# Altium project roach2_project rev2.PrjPCB (part 3 of 13)

## Sheet jtag_levelxlate.SchDoc: JTAG and Level Translation
size A3; Date: DO NOT USE, RATHER USE PROJ OPTIONS; DrawnBy: DO NOT USE, RATHER USE PROJ OPTIONS; Engineer: DO NOT USE, RATHER USE PROJ OPTIONS; Organization: DO NOT USE, RATHER USE PROJ OPTIONS; DocumentNumber: DO NOT USE, RATHER USE PROJ OPTIONS; Revision: DO NOT USE, RATHER USE PROJ OPTIONS; SheetNumber: 26; SheetTotal: 27; SCH_Sheet_Filename: jtag_levelxlate.SchDoc; CurrentTime: DO NOT USE, RATHER USE PROJ OPTIONS; Time: DO NOT USE, RATHER USE PROJ OPTIONS; DocumentFullPathAndName: DO NOT USE, RATHER USE PROJ OPTIONS; DocumentName: DO NOT USE, RATHER USE PROJ OPTIONS; ModifiedDate: DO NOT USE, RATHER USE PROJ OPTIONS; ImagePath: DO NOT USE, RATHER USE PROJ OPTIONS
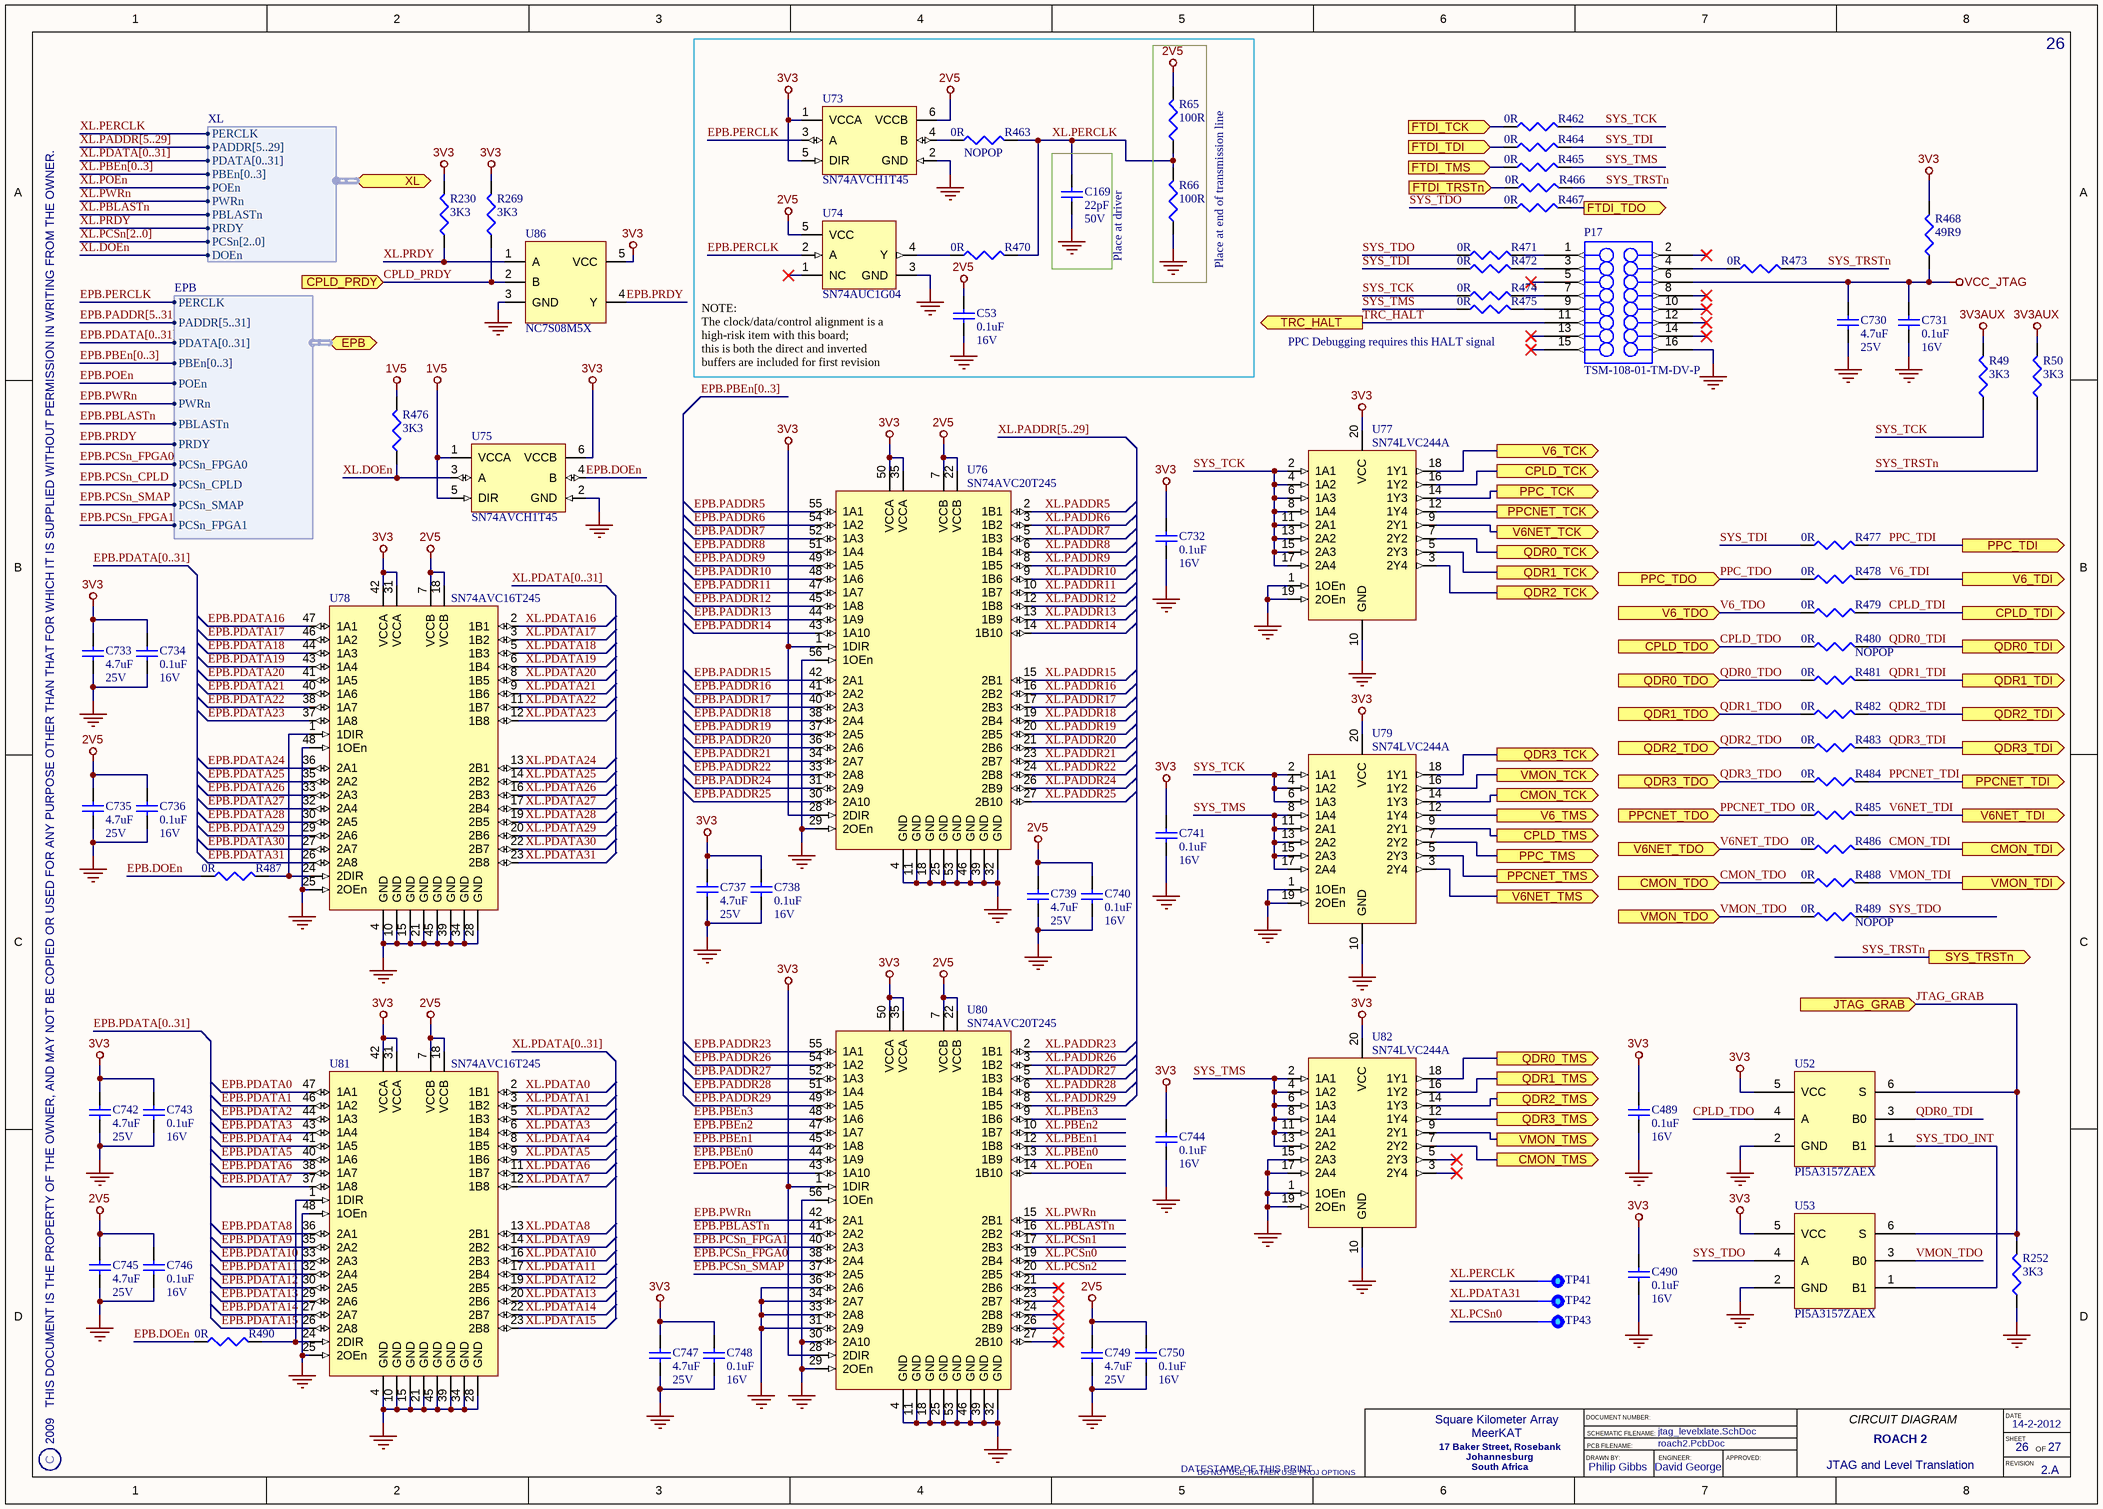
[diagram p4: jtag_levelxlate.SchDoc]

### Parts
C53  Rating: 16V  [CAPC1005X60L]  (hidden comment: 0.1uF)
C169  Rating: 50V  [CAPC1005X55L]  (hidden comment: 22pF)
C489  Rating: 16V  [CAPC1005X60L]  (hidden comment: 0.1uF)
C490  Rating: 16V  [CAPC1005X60L]  (hidden comment: 0.1uF)
C730  Rating: 25V  [CAPC2012X127L]  (hidden comment: 4.7uF)
C731  Rating: 16V  [CAPC1005X60L]  (hidden comment: 0.1uF)
C732  Rating: 16V  [CAPC1005X60L]  (hidden comment: 0.1uF)
C733  Rating: 25V  [CAPC2012X127L]  (hidden comment: 4.7uF)
C734  Rating: 16V  [CAPC1005X60L]  (hidden comment: 0.1uF)
C735  Rating: 25V  [CAPC2012X127L]  (hidden comment: 4.7uF)
C736  Rating: 16V  [CAPC1005X60L]  (hidden comment: 0.1uF)
C737  Rating: 25V  [CAPC2012X127L]  (hidden comment: 4.7uF)
C738  Rating: 16V  [CAPC1005X60L]  (hidden comment: 0.1uF)
C739  Rating: 25V  [CAPC2012X127L]  (hidden comment: 4.7uF)
C740  Rating: 16V  [CAPC1005X60L]  (hidden comment: 0.1uF)
C741  Rating: 16V  [CAPC1005X60L]  (hidden comment: 0.1uF)
C742  Rating: 25V  [CAPC2012X127L]  (hidden comment: 4.7uF)
C743  Rating: 16V  [CAPC1005X60L]  (hidden comment: 0.1uF)
C744  Rating: 16V  [CAPC1005X60L]  (hidden comment: 0.1uF)
C745  Rating: 25V  [CAPC2012X127L]  (hidden comment: 4.7uF)
C746  Rating: 16V  [CAPC1005X60L]  (hidden comment: 0.1uF)
C747  Rating: 25V  [CAPC2012X127L]  (hidden comment: 4.7uF)
C748  Rating: 16V  [CAPC1005X60L]  (hidden comment: 0.1uF)
C749  Rating: 25V  [CAPC2012X127L]  (hidden comment: 4.7uF)
C750  Rating: 16V  [CAPC1005X60L]  (hidden comment: 0.1uF)
P17  TSM-108-01-TM-DV-P  [SAMTEC_TSM-108-01-TM-DV-P]
R49  3K3  [RESC1005X40L]
R50  3K3  [RESC1005X40L]
R65  100R  [RESC1005X40L]
R66  100R  [RESC1005X40L]
R230  3K3  [RESC1005X40L]
R252  3K3  [RESC1005X40L]
R269  3K3  [RESC1005X40L]
R462  0R  [RESC1005X40L]
R463  0R  [RESC1005X40L]
R464  0R  [RESC1005X40L]
R465  0R  [RESC1005X40L]
R466  0R  [RESC1005X40L]
R467  0R  [RESC1005X40L]
R468  49R9  [RESC1005X40L]
R470  0R  [RESC1005X40L]
R471  0R  [RESC1005X40L]
R472  0R  [RESC1005X40L]
R473  0R  [RESC1005X40L]
R474  0R  [RESC1005X40L]
R475  0R  [RESC1005X40L]
R476  3K3  [RESC1005X40L]
R477  0R  [RESC1005X40L]
R478  0R  [RESC1005X40L]
R479  0R  [RESC1005X40L]
R480  0R  [RESC1005X40L]
R481  0R  [RESC1005X40L]
R482  0R  [RESC1005X40L]
R483  0R  [RESC1005X40L]
R484  0R  [RESC1005X40L]
R485  0R  [RESC1005X40L]
R486  0R  [RESC1005X40L]
R487  0R  [RESC1005X40L]
R488  0R  [RESC1005X40L]
R489  0R  [RESC1005X40L]
R490  0R  [RESC1005X40L]
TP41  Testpoint  [TP100]  (value not drawn)  (no BOM)
TP42  Testpoint  [TP100]  (value not drawn)  (no BOM)
TP43  Testpoint  [TP100]  (value not drawn)  (no BOM)
U52  PI5A3157ZAEX  [SC70-6]
U53  PI5A3157ZAEX  [SC70-6]
U73  SN74AVCH1T45  [SOT23-6]
U74  SN74AUC1G04  [SOT23-5]
U75  SN74AVCH1T45  [SOT23-6]
U76  SN74AVC20T245  [PW056]
U77  SN74LVC244A  [PW020]
U78  SN74AVC16T245  [PW048]
U79  SN74LVC244A  [PW020]
U80  SN74AVC20T245  [PW056]
U81  SN74AVC16T245  [PW048]
U82  SN74LVC244A  [PW020]
U86  NC7S08M5X  [SOT23-5]

### Ports
CMON_TCK (out), CMON_TDI (out), CMON_TDO (in), CMON_TMS (out), CPLD_PRDY (in), CPLD_TCK (out), CPLD_TDI (out), CPLD_TDO (in), CPLD_TMS (out), EPB (harness EPB), FTDI_TCK (in), FTDI_TDI (in), FTDI_TDO (out), FTDI_TMS (in), FTDI_TRSTn (in), JTAG_GRAB (in), PPC_TCK (out), PPC_TDI (out), PPC_TDO (in), PPC_TMS (out), PPCNET_TCK (out), PPCNET_TDI (out), PPCNET_TDO (in), PPCNET_TMS (out), QDR0_TCK (out), QDR0_TDI (out), QDR0_TDO (in), QDR0_TMS (out), QDR1_TCK (out), QDR1_TDI (out), QDR1_TDO (in), QDR1_TMS (out), QDR2_TCK (out), QDR2_TDI (out), QDR2_TDO (in), QDR2_TMS (out), QDR3_TCK (out), QDR3_TDI (out), QDR3_TDO (in), QDR3_TMS (out), SYS_TRSTn (out), TRC_HALT (out), V6_TCK (out), V6_TDI (out), V6_TDO (in), V6_TMS (out), V6NET_TCK (out), V6NET_TDI (out), V6NET_TDO (in), V6NET_TMS (out), VMON_TCK (out), VMON_TDI (out), VMON_TDO (in), VMON_TMS (out), XL (harness XL)

### Harnesses
EPB: PERCLK, PADDR[5..31], PDATA[0..31], PBEn[0..3], POEn, PWRn, PBLASTn, PRDY, PCSn_FPGA0, PCSn_CPLD, PCSn_SMAP, PCSn_FPGA1
XL: PERCLK, PADDR[5..29], PDATA[0..31], PBEn[0..3], POEn, PWRn, PBLASTn, PRDY, PCSn[2..0], DOEn

### Nets
1V5: R476.2 U75.1(VCCA) U75.5(DIR)
2V5: C53.2 C735.2 C736.2 C739.2 C740.2 C745.2 C746.2 C749.2 C750.2 R65.2 U73.6(VCCB) U74.5(VCC) U76.7(VCCB) U76.22(VCCB) U78.7(VCCB) U78.18(VCCB) U80.7(VCCB) U80.22(VCCB) U81.7(VCCB) U81.18(VCCB)
3V3: C489.2 C490.2 C732.2 C733.2 C734.2 C737.2 C738.2 C741.2 C742.2 C743.2 C744.2 C747.2 C748.2 R230.2 R269.2 R468.2 U52.5(VCC) U53.5(VCC) U73.1(VCCA) U73.5(DIR) U75.6(VCCB) U76.1(1DIR) U76.28(2DIR) U76.35(VCCA) U76.50(VCCA) U77.20(VCC) U78.31(VCCA) U78.42(VCCA) U79.20(VCC) U80.1(1DIR) U80.28(2DIR) U80.35(VCCA) U80.50(VCCA) U81.31(VCCA) U81.42(VCCA) U82.20(VCC) U86.5(VCC)
3V3AUX: R49.2 R50.2
GND: C53.1 C169.1 C489.1 C490.1 C730.1 C731.1 C732.1 C733.1 C734.1 C735.1 C736.1 C737.1 C738.1 C739.1 C740.1 C741.1 C742.1 C743.1 C744.1 C745.1 C746.1 C747.1 C748.1 C749.1 C750.1 P17.16(B16) R66.1 R252.1 U52.2(GND) U53.2(GND) U73.2(GND) U74.3(GND) U75.2(GND) U76.4(GND) U76.11(GND) U76.18(GND) U76.25(GND) U76.29(2OEn) U76.32(GND) U76.39(GND) U76.46(GND) U76.53(GND) U76.56(1OEn) U77.1(1OEn) U77.10(GND) U77.19(2OEn) U78.4(GND) U78.10(GND) U78.15(GND) U78.21(GND) U78.25(2OEn) U78.28(GND) U78.34(GND) U78.39(GND) U78.45(GND) U78.48(1OEn) U79.1(1OEn) U79.10(GND) U79.19(2OEn) U80.4(GND) U80.11(GND) U80.18(GND) U80.25(GND) U80.29(2OEn) U80.30(2A10) U80.31(2A9) U80.32(GND) U80.33(2A8) U80.34(2A7) U80.36(2A6) U80.39(GND) U80.46(GND) U80.53(GND) U80.56(1OEn) U81.4(GND) U81.10(GND) U81.15(GND) U81.21(GND) U81.25(2OEn) U81.28(GND) U81.34(GND) U81.39(GND) U81.45(GND) U81.48(1OEn) U82.1(1OEn) U82.10(GND) U82.15(2A3) U82.17(2A4) U82.19(2OEn) U86.3(GND)
VCC_JTAG: C730.2 C731.2 P17.6(B6) R468.1
CMON_TCK: U79.14(1Y3) ; port CMON_TCK
CMON_TDI: R486.2 ; port CMON_TDI
CMON_TDO: R488.1 ; port CMON_TDO
CMON_TMS: U82.7(2Y2) ; port CMON_TMS
CPLD_PRDY: R269.1 U86.2(B) ; port CPLD_PRDY
CPLD_TCK: U77.16(1Y2) ; port CPLD_TCK
CPLD_TDI: R479.2 ; port CPLD_TDI
CPLD_TDO: R480.1 U52.4(A) ; port CPLD_TDO
CPLD_TMS: U79.9(2Y1) ; port CPLD_TMS
EPB.DOEn: R487.1 R490.1 U75.4(B)
EPB.PADDR5: U76.55(1A1)
EPB.PADDR6: U76.54(1A2)
EPB.PADDR7: U76.52(1A3)
EPB.PADDR8: U76.51(1A4)
EPB.PADDR9: U76.49(1A5)
EPB.PADDR10: U76.48(1A6)
EPB.PADDR11: U76.47(1A7)
EPB.PADDR12: U76.45(1A8)
EPB.PADDR13: U76.44(1A9)
EPB.PADDR14: U76.43(1A10)
EPB.PADDR15: U76.42(2A1)
EPB.PADDR16: U76.41(2A2)
EPB.PADDR17: U76.40(2A3)
EPB.PADDR18: U76.38(2A4)
EPB.PADDR19: U76.37(2A5)
EPB.PADDR20: U76.36(2A6)
EPB.PADDR21: U76.34(2A7)
EPB.PADDR22: U76.33(2A8)
EPB.PADDR23: U80.55(1A1)
EPB.PADDR24: U76.31(2A9)
EPB.PADDR25: U76.30(2A10)
EPB.PADDR26: U80.54(1A2)
EPB.PADDR27: U80.52(1A3)
EPB.PADDR28: U80.51(1A4)
EPB.PADDR29: U80.49(1A5)
EPB.PBEn0: U80.44(1A9)
EPB.PBEn1: U80.45(1A8)
EPB.PBEn2: U80.47(1A7)
EPB.PBEn3: U80.48(1A6)
EPB.PBLASTn: U80.41(2A2) ; port EPB.PBLASTn
EPB.PCSn_FPGA0: U80.38(2A4) ; port EPB.PCSn_FPGA0
EPB.PCSn_FPGA1: U80.40(2A3) ; port EPB.PCSn_FPGA1
EPB.PCSn_SMAP: U80.37(2A5) ; port EPB.PCSn_SMAP
EPB.PDATA0: U81.47(1A1)
EPB.PDATA1: U81.46(1A2)
EPB.PDATA2: U81.44(1A3)
EPB.PDATA3: U81.43(1A4)
EPB.PDATA4: U81.41(1A5)
EPB.PDATA5: U81.40(1A6)
EPB.PDATA6: U81.38(1A7)
EPB.PDATA7: U81.37(1A8)
EPB.PDATA8: U81.36(2A1)
EPB.PDATA9: U81.35(2A2)
EPB.PDATA10: U81.33(2A3)
EPB.PDATA11: U81.32(2A4)
EPB.PDATA12: U81.30(2A5)
EPB.PDATA13: U81.29(2A6)
EPB.PDATA14: U81.27(2A7)
EPB.PDATA15: U81.26(2A8)
EPB.PDATA16: U78.47(1A1)
EPB.PDATA17: U78.46(1A2)
EPB.PDATA18: U78.44(1A3)
EPB.PDATA19: U78.43(1A4)
EPB.PDATA20: U78.41(1A5)
EPB.PDATA21: U78.40(1A6)
EPB.PDATA22: U78.38(1A7)
EPB.PDATA23: U78.37(1A8)
EPB.PDATA24: U78.36(2A1)
EPB.PDATA25: U78.35(2A2)
EPB.PDATA26: U78.33(2A3)
EPB.PDATA27: U78.32(2A4)
EPB.PDATA28: U78.30(2A5)
EPB.PDATA29: U78.29(2A6)
EPB.PDATA30: U78.27(2A7)
EPB.PDATA31: U78.26(2A8)
EPB.PERCLK: U73.3(A) U74.2(A) ; port EPB.PERCLK
EPB.POEn: U80.43(1A10) ; port EPB.POEn
EPB.PRDY: U86.4(Y) ; port EPB.PRDY
EPB.PWRn: U80.42(2A1) ; port EPB.PWRn
FTDI_TCK: R462.1 ; port FTDI_TCK
FTDI_TDI: R464.1 ; port FTDI_TDI
FTDI_TDO: R467.2 ; port FTDI_TDO
FTDI_TMS: R465.1 ; port FTDI_TMS
FTDI_TRSTn: R466.1 ; port FTDI_TRSTn
JTAG_GRAB: R252.2 U52.6(S) U53.6(S) ; port JTAG_GRAB
PPC_TCK: U77.14(1Y3) ; port PPC_TCK
PPC_TDI: R477.2 ; port PPC_TDI
PPC_TDO: R478.1 ; port PPC_TDO
PPC_TMS: U79.7(2Y2) ; port PPC_TMS
PPCNET_TCK: U77.12(1Y4) ; port PPCNET_TCK
PPCNET_TDI: R484.2 ; port PPCNET_TDI
PPCNET_TDO: R485.1 ; port PPCNET_TDO
PPCNET_TMS: U79.5(2Y3) ; port PPCNET_TMS
QDR0_TCK: U77.7(2Y2) ; port QDR0_TCK
QDR0_TDI: R480.2 U52.3(B0) ; port QDR0_TDI
QDR0_TDO: R481.1 ; port QDR0_TDO
QDR0_TMS: U82.18(1Y1) ; port QDR0_TMS
QDR1_TCK: U77.5(2Y3) ; port QDR1_TCK
QDR1_TDI: R481.2 ; port QDR1_TDI
QDR1_TDO: R482.1 ; port QDR1_TDO
QDR1_TMS: U82.16(1Y2) ; port QDR1_TMS
QDR2_TCK: U77.3(2Y4) ; port QDR2_TCK
QDR2_TDI: R482.2 ; port QDR2_TDI
QDR2_TDO: R483.1 ; port QDR2_TDO
QDR2_TMS: U82.14(1Y3) ; port QDR2_TMS
QDR3_TCK: U79.18(1Y1) ; port QDR3_TCK
QDR3_TDI: R483.2 ; port QDR3_TDI
QDR3_TDO: R484.1 ; port QDR3_TDO
QDR3_TMS: U82.12(1Y4) ; port QDR3_TMS
SYS_TCK: R49.1 R462.2 R474.1 U77.2(1A1) U77.4(1A2) U77.6(1A3) U77.8(1A4) U77.11(2A1) U77.13(2A2) U77.15(2A3) U77.17(2A4) U79.2(1A1) U79.4(1A2) U79.6(1A3)
SYS_TDI: R464.2 R472.1 R477.1
SYS_TDO: R467.1 R471.1 R489.2 U53.4(A)
SYS_TDO_INT: U52.1(B1) U53.1(B1)
SYS_TMS: R465.2 R475.1 U79.8(1A4) U79.11(2A1) U79.13(2A2) U79.15(2A3) U79.17(2A4) U82.2(1A1) U82.4(1A2) U82.6(1A3) U82.8(1A4) U82.11(2A1) U82.13(2A2)
SYS_TRSTn: R50.1 R466.2 R473.2 ; port SYS_TRSTn
TRC_HALT: P17.11(A11) ; port TRC_HALT
V6_TCK: U77.18(1Y1) ; port V6_TCK
V6_TDI: R478.2 ; port V6_TDI
V6_TDO: R479.1 ; port V6_TDO
V6_TMS: U79.12(1Y4) ; port V6_TMS
V6NET_TCK: U77.9(2Y1) ; port V6NET_TCK
V6NET_TDI: R485.2 ; port V6NET_TDI
V6NET_TDO: R486.1 ; port V6NET_TDO
V6NET_TMS: U79.3(2Y4) ; port V6NET_TMS
VMON_TCK: U79.16(1Y2) ; port VMON_TCK
VMON_TDI: R488.2 ; port VMON_TDI
VMON_TDO: R489.1 U53.3(B0) ; port VMON_TDO
VMON_TMS: U82.9(2Y1) ; port VMON_TMS
XL.DOEn: R476.1 U75.3(A) ; port XL.DOEn
XL.PADDR5: U76.2(1B1)
XL.PADDR6: U76.3(1B2)
XL.PADDR7: U76.5(1B3)
XL.PADDR8: U76.6(1B4)
XL.PADDR9: U76.8(1B5)
XL.PADDR10: U76.9(1B6)
XL.PADDR11: U76.10(1B7)
XL.PADDR12: U76.12(1B8)
XL.PADDR13: U76.13(1B9)
XL.PADDR14: U76.14(1B10)
XL.PADDR15: U76.15(2B1)
XL.PADDR16: U76.16(2B2)
XL.PADDR17: U76.17(2B3)
XL.PADDR18: U76.19(2B4)
XL.PADDR19: U76.20(2B5)
XL.PADDR20: U76.21(2B6)
XL.PADDR21: U76.23(2B7)
XL.PADDR22: U76.24(2B8)
XL.PADDR23: U80.2(1B1)
XL.PADDR24: U76.26(2B9)
XL.PADDR25: U76.27(2B10)
XL.PADDR26: U80.3(1B2)
XL.PADDR27: U80.5(1B3)
XL.PADDR28: U80.6(1B4)
XL.PADDR29: U80.8(1B5)
XL.PBEn0: U80.13(1B9)
XL.PBEn1: U80.12(1B8)
XL.PBEn2: U80.10(1B7)
XL.PBEn3: U80.9(1B6)
XL.PBLASTn: U80.16(2B2) ; port XL.PBLASTn
XL.PCSn0: TP43.1 U80.19(2B4)
XL.PCSn1: U80.17(2B3)
XL.PCSn2: U80.20(2B5)
XL.PDATA0: U81.2(1B1)
XL.PDATA1: U81.3(1B2)
XL.PDATA2: U81.5(1B3)
XL.PDATA3: U81.6(1B4)
XL.PDATA4: U81.8(1B5)
XL.PDATA5: U81.9(1B6)
XL.PDATA6: U81.11(1B7)
XL.PDATA7: U81.12(1B8)
XL.PDATA8: U81.13(2B1)
XL.PDATA9: U81.14(2B2)
XL.PDATA10: U81.16(2B3)
XL.PDATA11: U81.17(2B4)
XL.PDATA12: U81.19(2B5)
XL.PDATA13: U81.20(2B6)
XL.PDATA14: U81.22(2B7)
XL.PDATA15: U81.23(2B8)
XL.PDATA16: U78.2(1B1)
XL.PDATA17: U78.3(1B2)
XL.PDATA18: U78.5(1B3)
XL.PDATA19: U78.6(1B4)
XL.PDATA20: U78.8(1B5)
XL.PDATA21: U78.9(1B6)
XL.PDATA22: U78.11(1B7)
XL.PDATA23: U78.12(1B8)
XL.PDATA24: U78.13(2B1)
XL.PDATA25: U78.14(2B2)
XL.PDATA26: U78.16(2B3)
XL.PDATA27: U78.17(2B4)
XL.PDATA28: U78.19(2B5)
XL.PDATA29: U78.20(2B6)
XL.PDATA30: U78.22(2B7)
XL.PDATA31: TP42.1 U78.23(2B8)
XL.PERCLK: C169.2 R65.1 R66.2 R463.2 R470.2 TP41.1 ; port XL.PERCLK
XL.POEn: U80.14(1B10) ; port XL.POEn
XL.PRDY: R230.1 U86.1(A) ; port XL.PRDY
XL.PWRn: U80.15(2B1) ; port XL.PWRn
NetP17_1: P17.1(A1) R471.2
NetP17_3: P17.3(A3) R472.2
NetP17_4: P17.4(B4) R473.1
NetP17_7: P17.7(A7) R474.2
NetP17_9: P17.9(A9) R475.2
NetR463_1: R463.1 U73.4(B)
NetR470_1: R470.1 U74.4(Y)
NetR487_2: R487.2 U78.1(1DIR) U78.24(2DIR)
NetR490_2: R490.2 U81.1(1DIR) U81.24(2DIR)

Not connected (* = marked no-connect by the designer): P17 2(B2)* 5(A5)* 8(B8)* 10(B10)* 12(B12)* 13(A13)* 14(B14)* 15(A15)*; U74 1(NC)*; U80 21(2B6)* 23(2B7)* 24(2B8)* 26(2B9)* 27(2B10)*; U82 3(2Y4)* 5(2Y3)*

### Buses and harness runs
bus EPB.PADDR[5..31]
bus EPB.PBEn[0..3]
bus EPB.PDATA[0..31]
bus XL.PADDR[5..29]
bus XL.PBEn[0..3]
bus XL.PCSn[2..0]
bus XL.PDATA[0..31]

### Notes on the sheet
- (near R463) NOPOP
- Place at driver
- Place at end of transmission line
- (near U74) NOTE:
  The clock/data/control alignment is a
  high-risk item with this board;
  this is both the direct and inverted
  buffers are included for first revision
- PPC Debugging requires this HALT signal
- (near R480) NOPOP
- (near R489) NOPOP
- 2009   THIS DOCUMENT IS THE PROPERTY OF THE OWNER, AND MAY NOT BE COPIED OR USED FOR ANY PURPOSE OTHER THAN THAT FOR WHICH IT IS SUPPLIED WITHOUT PERMISSION IN WRITING FROM THE OWNER.
- C
- DATESTAMP OF THIS PRINT
- DRAWN BY:
- DOCUMENT NUMBER:
- SCHEMATIC FILENAME:
- PCB FILENAME:
- ENGINEER:
- APPROVED:
- CIRCUIT DIAGRAM
- DATE
- SHEET
- REVISION
- OF

### Library data of the parts
C53 C489 C490 C731 C732 C734 C736 C738 C740 C741 C743 C744 C746 C748 C750 = CAP-CER-1: 0.1uF, Ceramic Capacitor; Manufacturer: VENKEL; PartNum: C0402X7R160-104KN; Tolerance: 10%; Dielectric: X7R; POD number: CAP-CER-1; Value: 0.1uF; RoHS: Y; Sort Value: 0.1; Category: Capacitors; Subcategory: Ceramic
C169 = CAP-CER-2: 22pF, Ceramic Capacitor; Manufacturer: MURATA; PartNum: GRM1555C1H220JZ01D; Tolerance: 5%; Dielectric: C0G; POD number: CAP-CER-2; Value: 22pF; RoHS: Y; Sort Value: 0.000022; Category: Capacitors; Subcategory: Ceramic
C730 C733 C735 C737 C739 C742 C745 C747 C749 = CAP-CER-3: 4.7uF, Ceramic Capacitor; Manufacturer: MURATA; PartNum: GRM21BR61E475KA12K; Tolerance: 10%; Dielectric: X5R; POD number: CAP-CER-3; Value: 4.7uF; RoHS: Y; Sort Value: 4.7; Category: Capacitors; Subcategory: Ceramic
P17 = CONN-PCB-11: 2x8, 2.54 mm Pitch, Male Header; Manufacturer: SAMTEC; POD number: CONN-PCB-11; PartNum: TSM-108-01-TM-DV-P; RoHS: Y; Category: CONN; Subcategory: PCB
R49 R50 R230 R252 R269 R476 = RES-TF-7: 3K3, 1.1mm x 0.5mm, Thick Film Resistor; Manufacturer: ROYALOHM; PartNum: 0402WGJ0332T1E; Tolerance: 5%; Rating: 0.0625W; POD number: RES-TF-7; Value: 3K3; Sort Value: 3300; Category: Resistors; Subcategory: ThickFilm; HelpURL: *.pdf
R65 R66 = RES-TF-14: 100R, 1.1mm x 0.5mm, Thick Film Resistor; Manufacturer: ROYALOHM; PartNum: 0402WGF0101T1E; Tolerance: 1%; Rating: 0.0625W; POD number: RES-TF-14; Value: 100R; Sort Value: 100; Category: Resistors; Subcategory: ThickFilm; HelpURL: http://www.royalohm.com/pdf/general.pdf
R462-R467 R470-R475 R477-R490 = RES-TF-0: 0R, 1.1mm x 0.5mm, Thick Film Resistor; Manufacturer: ROYALOHM; PartNum: 0402WG00000T1E; Tolerance: 0%; Rating: 0.0625W; POD number: RES-TF-0; Value: 0R; Sort Value: 0; Category: Resistors; Subcategory: ThickFilm; HelpURL: *.pdf
R468 = RES-TF-10: 49R9, 1.1mm x 0.5mm, Thick Film Resistor; Manufacturer: ROYALOHM; PartNum: 0402WGF499JT1E; Tolerance: 1%; Rating: 0.0625W; POD number: RES-TF-10; Value: 49R9; Sort Value: 49.9; Category: Resistors; Subcategory: ThickFilm; HelpURL: *.pdf
TP41-TP43 = ELMECH-TP-0: 1mm Diameter, through-hole, Circular Test-point; POD number: ELMECH-TP-0; RoHS: Y; Category: ELMECH; Subcategory: Test Points
U52 U53 = IC-LOG-5: Low voltage SPDT Analogue Switch; Manufacturer: PERICOM; POD number: IC-LOG-5; PartNum: PI5A3157ZAEX; RoHS: Y; Category: IC; Subcategory: Logic
U73 U75 = IC-LOG-13: Single-Bit Dual Supply Bus Transceiver with Configurable Voltage Translation and 3-State Outputs; Manufacturer: Texas Instruments; POD number: IC-LOG-13; PartNum: SN74AVCH1T45; RoHS: Y; Category: IC; Subcategory: Logic
U74 = IC-LOG-1: Single Inverter Gate; Manufacturer: Texas Instruments; POD number: IC-LOG-1; PartNum: SN74AUC1G04; RoHS: Y; Category: IC; Subcategory: Logic
U76 U80 = IC-LOG-12: 20-Bit Dual-Supply Bus Transceivers with Configurable Voltage Translation and 3-State Outputs; Manufacturer: Texas Instruments; POD number: IC-LOG-12; PartNum: SN74AVC20T245; RoHS: Y; Category: IC; Subcategory: Logic
U77 U79 U82 = IC-LOG-4: Octal Buffer/Drive with 3-State Outputs; Manufacturer: Texas Instruments; POD number: IC-LOG-4; PartNum: SN74LVC244A; RoHS: Y; Category: IC; Subcategory: Logic
U78 U81 = IC-LOG-11: 16-BIT DUAL-SUPPLY BUS TRANSCEIVER WITH CONFIGURABLE VOLTAGE TRANSLATION AND 3-STATE OUTPUTS; Manufacturer: Texas Instruments; POD number: IC-LOG-11; PartNum: SN74AVC16T245; RoHS: Y; Category: IC; Subcategory: Logic
U86 = IC-LOG-0: TinyLogic® HS 2-Input AND Gate; Manufacturer: Fairchild Semiconductor; POD number: IC-LOG-0; PartNum: NC7S08M5X; RoHS: Y; Category: IC; Subcategory: Logic

## Sheet power_supply.SchDoc: Board Power Supplies
size A3; Date: DO NOT USE, RATHER USE PROJ OPTIONS; DrawnBy: DO NOT USE, RATHER USE PROJ OPTIONS; Engineer: DO NOT USE, RATHER USE PROJ OPTIONS; Organization: DO NOT USE, RATHER USE PROJ OPTIONS; DocumentNumber: DO NOT USE, RATHER USE PROJ OPTIONS; Revision: DO NOT USE, RATHER USE PROJ OPTIONS; SheetNumber: 2; SheetTotal: 29; SCH_Sheet_Filename: power_supply.SchDoc; CurrentTime: DO NOT USE, RATHER USE PROJ OPTIONS; Time: DO NOT USE, RATHER USE PROJ OPTIONS; DocumentFullPathAndName: DO NOT USE, RATHER USE PROJ OPTIONS; DocumentName: DO NOT USE, RATHER USE PROJ OPTIONS; ModifiedDate: DO NOT USE, RATHER USE PROJ OPTIONS; ImagePath: DO NOT USE, RATHER USE PROJ OPTIONS
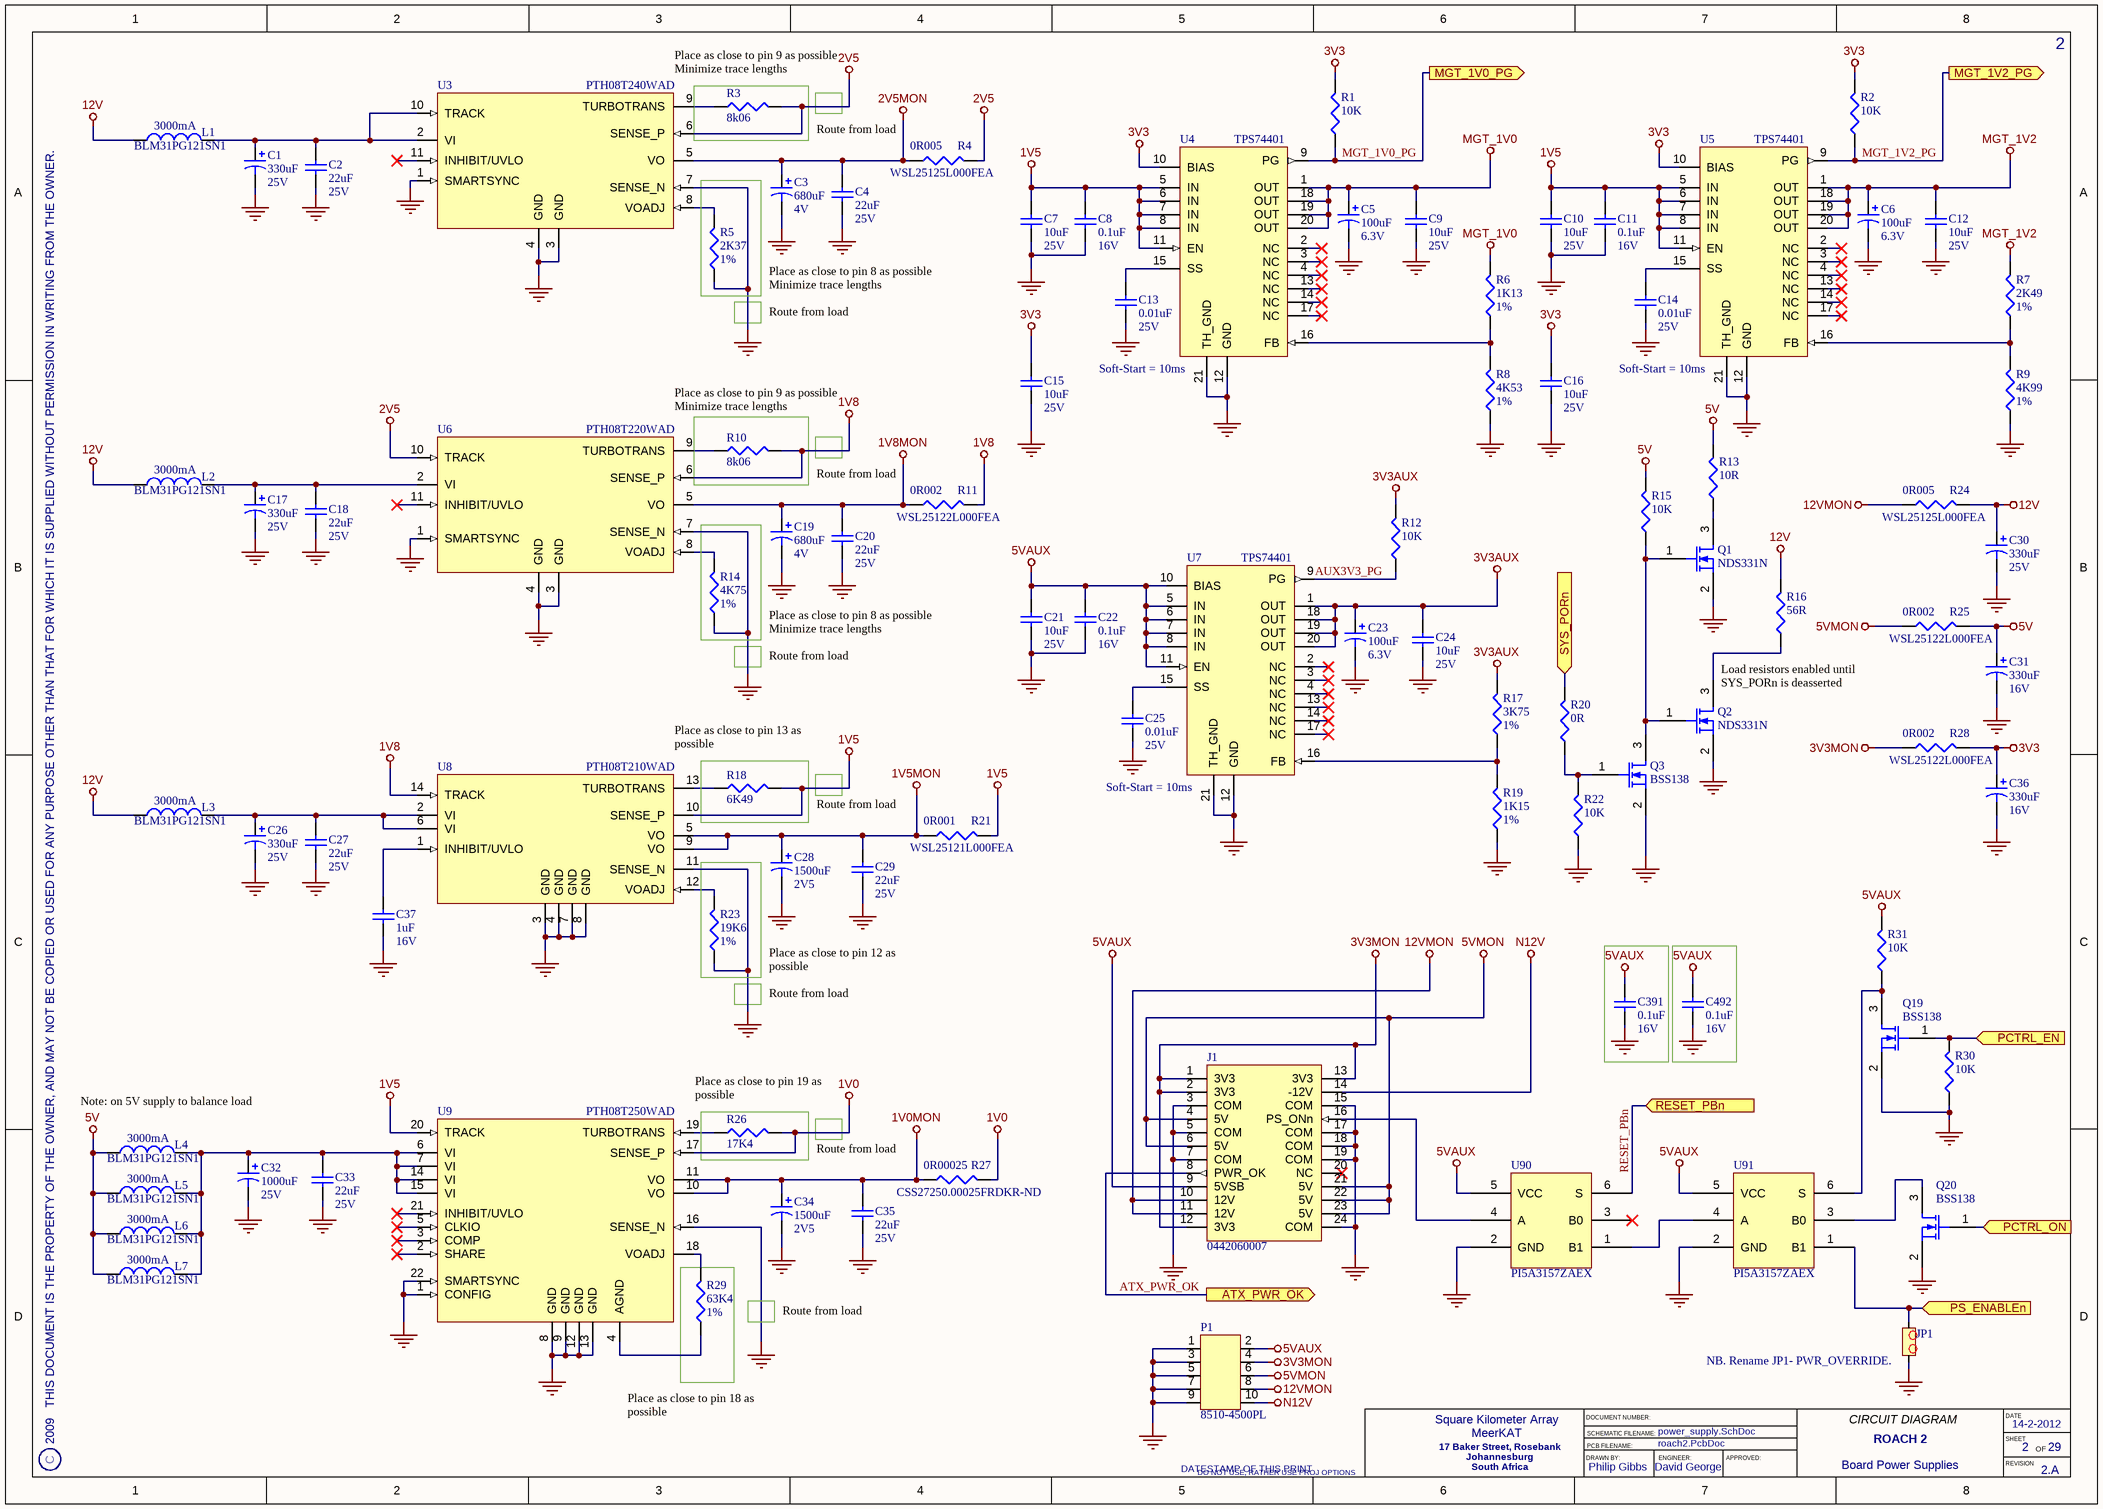
[diagram p5: power_supply.SchDoc]

### Parts
C1  Rating: 25V  [EEE1CA331UP]  (hidden comment: 330uF)
C2  Rating: 25V  [CAPC3225X270L]  (hidden comment: 22uF)
C3  Rating: 4V  [CAPMP7343X430L]  (hidden comment: 680uF)
C4  Rating: 25V  [CAPC3225X270L]  (hidden comment: 22uF)
C5  Rating: 6.3V  [CAPMP3528X210L]  (hidden comment: 100uF)
C6  Rating: 6.3V  [CAPMP3528X210L]  (hidden comment: 100uF)
C7  Rating: 25V  [CAPC3225X200L]  (hidden comment: 10uF)
C8  Rating: 16V  [CAPC1005X60L]  (hidden comment: 0.1uF)
C9  Rating: 25V  [CAPC3225X200L]  (hidden comment: 10uF)
C10  Rating: 25V  [CAPC3225X200L]  (hidden comment: 10uF)
C11  Rating: 16V  [CAPC1005X60L]  (hidden comment: 0.1uF)
C12  Rating: 25V  [CAPC3225X200L]  (hidden comment: 10uF)
C13  Rating: 25V  [CAPC1005X55L]  (hidden comment: 0.01uF)
C14  Rating: 25V  [CAPC1005X55L]  (hidden comment: 0.01uF)
C15  Rating: 25V  [CAPC3225X200L]  (hidden comment: 10uF)
C16  Rating: 25V  [CAPC3225X200L]  (hidden comment: 10uF)
C17  Rating: 25V  [EEE1CA331UP]  (hidden comment: 330uF)
C18  Rating: 25V  [CAPC3225X270L]  (hidden comment: 22uF)
C19  Rating: 4V  [CAPMP7343X430L]  (hidden comment: 680uF)
C20  Rating: 25V  [CAPC3225X270L]  (hidden comment: 22uF)
C21  Rating: 25V  [CAPC3225X200L]  (hidden comment: 10uF)
C22  Rating: 16V  [CAPC1005X60L]  (hidden comment: 0.1uF)
C23  Rating: 6.3V  [CAPMP3528X210L]  (hidden comment: 100uF)
C24  Rating: 25V  [CAPC3225X200L]  (hidden comment: 10uF)
C25  Rating: 25V  [CAPC1005X55L]  (hidden comment: 0.01uF)
C26  Rating: 25V  [EEE1CA331UP]  (hidden comment: 330uF)
C27  Rating: 25V  [CAPC3225X270L]  (hidden comment: 22uF)
C28  Rating: 2V5  [CAPMP7343X430L]  (hidden comment: 1500uF)
C29  Rating: 25V  [CAPC3225X270L]  (hidden comment: 22uF)
C30  Rating: 25V  [EEE1CA331UP]  (hidden comment: 330uF)
C31  Rating: 16V  [CAPMP7263X380L]  (hidden comment: 330uF)
C32  Rating: 25V  [CAPPRD750W80D1600H1500P]  (hidden comment: 1000uF)
C33  Rating: 25V  [CAPC3225X270L]  (hidden comment: 22uF)
C34  Rating: 2V5  [CAPMP7343X430L]  (hidden comment: 1500uF)
C35  Rating: 25V  [CAPC3225X270L]  (hidden comment: 22uF)
C36  Rating: 16V  [CAPMP7263X380L]  (hidden comment: 330uF)
C37  Rating: 16V  [CAPC2012X127L]  (hidden comment: 1uF)
C391  Rating: 16V  [CAPC1005X60L]  (hidden comment: 0.1uF)
C492  Rating: 16V  [CAPC1005X60L]  (hidden comment: 0.1uF)
J1  0442060007  [MOLEX_0442060007]
JP1  0022032021  [MOLEX_0022032021]  (value not drawn)
L1  Rating: 3000mA  PartNum: BLM31PG121SN1  [INDC3216X130L]  (hidden comment: 120R)
L2  Rating: 3000mA  PartNum: BLM31PG121SN1  [INDC3216X130L]  (hidden comment: 120R)
L3  Rating: 3000mA  PartNum: BLM31PG121SN1  [INDC3216X130L]  (hidden comment: 120R)
L4  Rating: 3000mA  PartNum: BLM31PG121SN1  [INDC3216X130L]  (hidden comment: 120R)
L5  Rating: 3000mA  PartNum: BLM31PG121SN1  [INDC3216X130L]  (hidden comment: 120R)
L6  Rating: 3000mA  PartNum: BLM31PG121SN1  [INDC3216X130L]  (hidden comment: 120R)
L7  Rating: 3000mA  PartNum: BLM31PG121SN1  [INDC3216X130L]  (hidden comment: 120R)
P1  8510-4500PL  [3M_8510-4500PL]
Q1  NDS331N  [SOT95P245X110-3N]
Q2  NDS331N  [SOT95P245X110-3N]
Q3  BSS138  [SOT95P245X110-3N]
Q19  BSS138  [SOT95P245X110-3N]
Q20  BSS138  [SOT95P245X110-3N]
R1  10K  [RESC1005X40L]
R2  10K  [RESC1005X40L]
R3  value 8k06  [RESC1005X40L]  (hidden comment: ResStd)
R4  PartNum: WSL25125L000FEA  [RESC6332X90M]  (hidden comment: 0R005)
R5  Tolerance: 1%  [RESC1005X40L]  (hidden comment: 2K37)
R6  Tolerance: 1%  [RESC1005X40L]  (hidden comment: 1K13)
R7  Tolerance: 1%  [RESC1005X40L]  (hidden comment: 2K49)
R8  Tolerance: 1%  [RESC1005X40L]  (hidden comment: 4K53)
R9  Tolerance: 1%  [RESC1005X40L]  (hidden comment: 4K99)
R10  value 8k06  [RESC1005X40L]  (hidden comment: ResStd)
R11  PartNum: WSL25122L000FEA  [RESC6332X90M]  (hidden comment: 0R002)
R12  10K  [RESC1005X40L]
R13  10R  [VISHAY_AC5]
R14  Tolerance: 1%  [RESC1005X40L]  (hidden comment: 4K75)
R15  10K  [RESC1005X40L]
R16  56R  [VISHAY_AC5]
R17  Tolerance: 1%  [RESC1005X40L]  (hidden comment: 3K75)
R18  value 6K49  [RESC1005X40L]  (hidden comment: ResStd)
R19  Tolerance: 1%  [RESC1005X40L]  (hidden comment: 1K15)
R20  0R  [RESC1005X40L]
R21  PartNum: WSL25121L000FEA  [RESC6332X90M]  (hidden comment: 0R001)
R22  10K  [RESC1005X40L]
R23  Tolerance: 1%  [RESC1005X40L]  (hidden comment: 19K6)
R24  PartNum: WSL25125L000FEA  [RESC6332X90M]  (hidden comment: 0R005)
R25  PartNum: WSL25122L000FEA  [RESC6332X90M]  (hidden comment: 0R002)
R26  value 17K4  [RESC1005X40L]  (hidden comment: ResStd)
R27  PartNum: CSS27250.00025FRDKR-ND  [RESC6867X140M]  (hidden comment: 0R00025)
R28  PartNum: WSL25122L000FEA  [RESC6332X90M]  (hidden comment: 0R002)
R29  Tolerance: 1%  [RESC1005X40L]  (hidden comment: 63K4)
R30  10K  [RESC1005X40L]
R31  10K  [RESC1005X40L]
U3  PTH08T240WAD  [DIP_Module_11PIN-A]
U4  TPS74401  [VQFN20]
U5  TPS74401  [VQFN20]
U6  PTH08T220WAD  [DIP_Module_11PIN]
U7  TPS74401  [VQFN20]
U8  PTH08T210WAD  [DIP_Module_14PIN]
U9  PTH08T250WAD  [DIP_Module_22PIN]
U90  PI5A3157ZAEX  [SC70-6]
U91  PI5A3157ZAEX  [SC70-6]

### Ports
ATX_PWR_OK (out), MGT_1V0_PG (out), MGT_1V2_PG (out), PCTRL_EN (in), PCTRL_ON (in), PS_ENABLEn (in), RESET_PBn (in), SYS_PORn (in)

### Nets
1V0: R26.2 R27.2 U9.17(SENSE_P)
1V0MON: C34.1 C35.2 R27.1 U9.10(VO) U9.11(VO)
1V5: C7.2 C8.2 C10.2 C11.2 R18.2 R21.2 U4.5(IN) U4.6(IN) U4.7(IN) U4.8(IN) U4.11(EN) U5.5(IN) U5.6(IN) U5.7(IN) U5.8(IN) U5.11(EN) U8.10(SENSE_P) U9.20(TRACK)
1V5MON: C28.1 C29.2 R21.1 U8.5(VO) U8.9(VO)
1V8: R10.2 R11.2 U6.6(SENSE_P) U8.14(TRACK)
1V8MON: C19.1 C20.2 R11.1 U6.5(VO)
2V5: R3.2 R4.2 U3.6(SENSE_P) U6.10(TRACK)
2V5MON: C3.1 C4.2 R4.1 U3.5(VO)
3V3: C15.2 C16.2 C36.1 R1.2 R2.2 R28.2 U4.10(BIAS) U5.10(BIAS)
3V3AUX: C23.1 C24.2 R12.2 R17.2 U7.1(OUT) U7.18(OUT) U7.19(OUT) U7.20(OUT)
3V3MON: J1.1(3V3) J1.2(3V3) J1.12(3V3) J1.13(3V3) P1.4 R28.1
5V: C31.1 L4.1 L5.1 L6.1 L7.1 R13.2 R15.2 R25.2
5VAUX: C21.2 C22.2 C391.2 C492.2 J1.9(5VSB) P1.2 R31.2 U7.5(IN) U7.6(IN) U7.7(IN) U7.8(IN) U7.10(BIAS) U7.11(EN) U90.5(VCC) U91.5(VCC)
5VMON: J1.4(5V) J1.6(5V) J1.21(5V) J1.22(5V) J1.23(5V) P1.6 R25.1
12V: C30.1 L1.1 L2.1 L3.1 R16.2 R24.2
12VMON: J1.10(12V) J1.11(12V) P1.8 R24.1
GND: C1.2 C2.1 C3.2 C4.1 C5.2 C6.2 C7.1 C8.1 C9.1 C10.1 C11.1 C12.1 C13.1 C14.1 C15.1 C16.1 C17.2 C18.1 C19.2 C20.1 C21.1 C22.1 C23.2 C24.1 C25.1 C26.2 C27.1 C28.2 C29.1 C30.2 C31.2 C32.2 C33.1 C34.2 C35.1 C36.2 C37.2 C391.1 C492.1 J1.3(COM) J1.5(COM) J1.7(COM) J1.15(COM) J1.17(COM) J1.18(COM) J1.19(COM) J1.24(COM) JP1.2 P1.1 P1.3 P1.5 P1.7 P1.9 Q1.2(S) Q2.2(S) Q3.2(S) Q19.2(S) Q20.2(S) R5.1 R8.1 R9.1 R14.1 R19.1 R22.1 R23.1 R30.1 U3.1(SMARTSYNC) U3.3(GND) U3.4(GND) U3.7(SENSE_N) U4.12(GND) U4.21(TH_GND) U5.12(GND) U5.21(TH_GND) U6.1(SMARTSYNC) U6.3(GND) U6.4(GND) U6.7(SENSE_N) U7.12(GND) U7.21(TH_GND) U8.3(GND) U8.4(GND) U8.7(GND) U8.8(GND) U8.11(SENSE_N) U9.1(CONFIG) U9.8(GND) U9.9(GND) U9.12(GND) U9.13(GND) U9.16(SENSE_N) U9.22(SMARTSYNC) U90.2(GND) U91.2(GND)
MGT_1V0: C5.1 C9.2 R6.2 U4.1(OUT) U4.18(OUT) U4.19(OUT) U4.20(OUT)
MGT_1V2: C6.1 C12.2 R7.2 U5.1(OUT) U5.18(OUT) U5.19(OUT) U5.20(OUT)
N12V: J1.14(-12V) P1.10
ATX_PWR_OK: J1.8(PWR_OK) ; port ATX_PWR_OK
AUX3V3_PG: R12.1 U7.9(PG)
MGT_1V0_PG: R1.1 U4.9(PG) ; port MGT_1V0_PG
MGT_1V2_PG: R2.1 U5.9(PG) ; port MGT_1V2_PG
PCTRL_EN: Q19.1(G) R30.2 ; port PCTRL_EN
PS_ENABLEn: JP1.1 U91.1(B1) ; port PS_ENABLEn
RESET_PBn: U90.6(S) ; port RESET_PBn
SYS_PORn: R20.2 ; port SYS_PORn
NetC1_1: C1.1 C2.2 L1.2 U3.2(VI) U3.10(TRACK)
NetC13_2: C13.2 U4.15(SS)
NetC14_2: C14.2 U5.15(SS)
NetC17_1: C17.1 C18.2 L2.2 U6.2(VI)
NetC25_2: C25.2 U7.15(SS)
NetC26_1: C26.1 C27.2 L3.2 U8.2(VI) U8.6(VI)
NetC32_1: C32.1 C33.2 L4.2 L5.2 L6.2 L7.2 U9.6(VI) U9.7(VI) U9.14(VI) U9.15(VI)
NetC37_1: C37.1 U8.1(INHIBIT/UVLO)
NetJ1_16: J1.16(PS_ONn) U90.4(A)
NetQ1_1: Q1.1(G) Q2.1(G) Q3.3(D) R15.1
NetQ1_3: Q1.3(D) R13.1
NetQ2_3: Q2.3(D) R16.1
NetQ3_1: Q3.1(G) R20.1 R22.2
NetQ19_3: Q19.3(D) R31.1 U91.6(S)
NetQ20_1: Q20.1(G) ; port PCTRL_ON
NetQ20_3: Q20.3(D) U91.3(B0)
NetR3_1: R3.1 U3.9(TURBOTRANS)
NetR5_2: R5.2 U3.8(VOADJ)
NetR6_1: R6.1 R8.2 U4.16(FB)
NetR7_1: R7.1 R9.2 U5.16(FB)
NetR10_1: R10.1 U6.9(TURBOTRANS)
NetR14_2: R14.2 U6.8(VOADJ)
NetR17_1: R17.1 R19.2 U7.16(FB)
NetR18_1: R18.1 U8.13(TURBOTRANS)
NetR23_2: R23.2 U8.12(VOADJ)
NetR26_1: R26.1 U9.19(TURBOTRANS)
NetR29_1: R29.1 U9.4(AGND)
NetR29_2: R29.2 U9.18(VOADJ)
NetU90_1: U90.1(B1) U91.4(A)

Not connected (* = marked no-connect by the designer): J1 20(NC)*; U3 11(INHIBIT/UVLO)*; U4 2(NC)* 3(NC)* 4(NC)* 13(NC)* 14(NC)* 17(NC)*; U5 2(NC)* 3(NC)* 4(NC)* 13(NC)* 14(NC)* 17(NC)*; U6 11(INHIBIT/UVLO)*; U7 2(NC)* 3(NC)* 4(NC)* 13(NC)* 14(NC)* 17(NC)*; U9 2(SHARE)* 3(COMP)* 5(CLKIO)* 21(INHIBIT/UVLO)*; U90 3(B0)*

### Notes on the sheet
- Place as close to pin 9 as possible
  Minimize trace lengths
- Route from load
- Place as close to pin 8 as possible
  Minimize trace lengths
- (near U4) Soft-Start = 10ms
- (near U5) Soft-Start = 10ms
- (near Q2) Load resistors enabled until SYS_PORn is deasserted
- Place as close to pin 13 as possible
  Minimize trace lengths
- (near U7) Soft-Start = 10ms
- Place as close to pin 12 as possible
  Minimize trace lengths
- Note: on 5V supply to balance load
- Place as close to pin 19 as possible
  Minimize trace lengths
- (near JP1) NB. Rename JP1- PWR_OVERRIDE.
- Place as close to pin 18 as possible
  Minimize trace lengths
- 2009   THIS DOCUMENT IS THE PROPERTY OF THE OWNER, AND MAY NOT BE COPIED OR USED FOR ANY PURPOSE OTHER THAN THAT FOR WHICH IT IS SUPPLIED WITHOUT PERMISSION IN WRITING FROM THE OWNER.
- C
- DATESTAMP OF THIS PRINT
- DRAWN BY:
- DOCUMENT NUMBER:
- SCHEMATIC FILENAME:
- PCB FILENAME:
- ENGINEER:
- APPROVED:
- CIRCUIT DIAGRAM
- DATE
- SHEET
- REVISION
- OF

### Library data of the parts
C1 C17 C26 C30 = CAP-ELC-1: 330uF, Surface Mount, Radial, Aluminium Electrolytic Capacitor; Manufacturer: PANASONIC-ECG; PartNum: EEE1EA331UP; Tolerance: 20%; POD number: CAP-ELC-1; Value: 330uF; RoHS: Y; Sort Value: 330; Category: Capacitors; Subcategory: Electrolytic
C2 C4 C18 C20 C27 C29 C33 C35 = CAP-CER-9: 22uF, Ceramic Capacitor; Manufacturer: MURATA; PartNum: GRM32ER61E226ME15L; Tolerance: 20%; Dielectric: X5R; POD number: CAP-CER-9; Value: 22uF; RoHS: Y; Sort Value: 22; Category: Capacitors; Subcategory: Ceramic
C3 C19 = CAP-TAN-8: 680uF, Conductive Polymer Chip Capacitor; Manufacturer: KEMET; PartNum: T520Y687M004ATE015; Tolerance: 20%; ESR: 0.015; POD number: CAP-TAN-8; Value: 680uF; RoHS: Y; Sort Value: 680; Category: Capacitors; Subcategory: Tantalum
C5 C6 C23 = CAP-TAN-6: 100uF, Low ESR, Tantalum Capacitor; Manufacturer: AVX; PartNum: TPSB107M006R0200; Tolerance: 20%; ESR: 0.2; POD number: CAP-TAN-6; Value: 100uF; RoHS: Y; Sort Value: 100; Category: Capacitors; Subcategory: Tantalum
C7 C9 C10 C12 C15 C16 C21 C24 = CAP-CER-5: 10uF, Ceramic Capacitor; Manufacturer: MURATA; PartNum: GRM32DR61E106KA12L; Tolerance: 10%; Dielectric: X5R; POD number: CAP-CER-5; Value: 10uF; RoHS: Y; Sort Value: 100; Category: Capacitors; Subcategory: Ceramic
C8 C11 C22 C391 C492 = CAP-CER-1: as C53 on sheet jtag_levelxlate; POD number: CAP-CER-1; Value: 0.1uF; RoHS: Y; Sort Value: 0.1; Category: Capacitors; Subcategory: Ceramic
C13 C14 C25 = CAP-CER-6: 0.01uF, Ceramic Capacitor; Manufacturer: MURATA; PartNum: GRM155R71E103KA01D; Tolerance: 10%; Dielectric: X7R; POD number: CAP-CER-6; Value: 0.01uF; RoHS: Y; Sort Value: 0.01; Category: Capacitors; Subcategory: Ceramic
C28 C34 = CAP-TAN-4: 1500uF, Conductive Polymer Chip Capacitor; Manufacturer: KEMET; PartNum: T530X158M2R5ATE005; Tolerance: 20%; ESR: 0.005; POD number: CAP-TAN-4; Value: 1500uF; RoHS: Y; Sort Value: 1500; Category: Capacitors; Subcategory: Tantalum
C31 C36 = CAP-TAN-3: 330uF, Solid Tantalum Chip Capacitor; Manufacturer: VISHAY; PartNum: 594D337X0016R2T; Tolerance: 20%; ESR: 0.055; POD number: CAP-TAN-3; Value: 330uF; RoHS: Y; Sort Value: 330; Category: Capacitors; Subcategory: Tantalum
C32 = CAP-ELC-0: 1000uF, Aluminium Electrolytic Capacitor; Manufacturer: PANASONIC-ECG; PartNum: EEUFC1E102S; Tolerance: 20%; POD number: CAP-ELC-0; Value: 1000uF; RoHS: Y; Sort Value: 1000; Category: Capacitors; Subcategory: Electrolytic
C37 = CAP-CER-8: 1uF, Ceramic Capacitor; Manufacturer: MURATA; PartNum: GRM21BR61C105KA01L; Tolerance: 10%; Dielectric: X5R; POD number: CAP-CER-8; RoHS: Y; Value: 1uF; Sort Value: 100; Category: Capacitors; Subcategory: Ceramic
J1 = CONN-PCB-5: 24-Pin ATX Connector; Manufacturer: Molex; POD number: CONN-PCB-5; PartNum: 0442060007; RoHS: Y; Category: CONN; Subcategory: PCB
JP1 = CONN-PCB-14: 1x2, 2.56mm, Header/Jumper; Manufacturer: Molex; POD number: CONN-PCB-14; PartNum: 0022032021; RoHS: Y; Category: CONN; Subcategory: PCB
L1-L7 = IND-FB-1: 120 Ohm, Chip Ferrite Brad; Manufacturer: Murata; DC Res: 0.025R; Tolerance: 25%; POD number: IND-FB-1; RoHS: Y; Value: 120R; Sort Value: 120; Category: Inductors; Subcategory: FerriteBead
P1 = CONN-PCB-13: 2x5, 2.54 mm Pitch, Through-hole, 1 Amp, Female Header; Manufacturer: 3M; POD number: CONN-PCB-13; PartNum: 8510-4500PL; RoHS: Y; Category: CONN; Subcategory: PCB
Q1 Q2 = TRANS-NFET-1: N-Channel Logic Level Enhancement Mode Field Effect Transistor; Manufacturer: Fairchild Semiconductor; Rating: 1.3A; POD number: TRANS-NFET-1; PartNum: NDS331N; RoHS: Y; Category: TRANS; Subcategory: NFET
Q3 Q19 Q20 = TRANS-NFET-0: N-Channel Logic Level Enhancement Mode Field Effect Transistor; Manufacturer: Fairchild Semiconductor; Rating: 0.22A; POD number: TRANS-NFET-0; PartNum: BSS138; RoHS: Y; Category: TRANS; Subcategory: NFET
R1 R2 R12 R15 R22 R30 R31 = RES-TF-5: 10K, 1.1mm x 0.5mm, Thick Film Resistor; Manufacturer: ROYALOHM; PartNum: 0402WGJ0103T1E; Tolerance: 5%; Rating: 0.0625W; POD number: RES-TF-5; Value: 10K; Sort Value: 10000; Category: Resistors; Subcategory: ThickFilm; HelpURL: *.pdf
R3 R10 = RES-TF-43: 8K06, 1.1mm x 0.5mm, Thick Film Resistor; POD number: RES-TF-43
R4 R24 = RES-MS-0: 5 milliohm, Power Metal Strip, Sense Resistor; Manufacturer: VISHAY; Tolerance: 1%; Rating: 1W; POD number: RES-MS-0; Value: 0R005; Sort Value: 0.005; Category: Resistors; Subcategory: MetalStrip
R5 = RES-TF-34: 2K37, 1.1mm x 0.5mm, Thick Film Resistor; Manufacturer: ROYALOHM; PartNum: 0402WGF2371T1E; Rating: 0.0625W; POD number: RES-TF-34; Value: 2K37; Sort Value: 2370; Category: Resistors; Subcategory: ThickFilm; HelpURL: *.pdf
R6 = RES-TF-35: 1K13, 1.1mm x 0.5mm, Thick Film Resistor; Manufacturer: ROYALOHM; PartNum: 0402WGF1131T1E; Rating: 0.0625W; POD number: RES-TF-35; Value: 1K13; Sort Value: 1130; Category: Resistors; Subcategory: ThickFilm; HelpURL: *.pdf
R7 = RES-TF-36: 2K49, 1.1mm x 0.5mm, Thick Film Resistor; Manufacturer: ROYALOHM; PartNum: 0402WGF2K49T1E; Rating: 0.0625W; POD number: RES-TF-36; Value: 2K49; Sort Value: 2490; Category: Resistors; Subcategory: ThickFilm; HelpURL: *.pdf
R8 = RES-TF-37: 4K53, 1.1mm x 0.5mm, Thick Film Resistor; Manufacturer: ROYALOHM; PartNum: 0402WGF4531T1E; Rating: 0.0625W; POD number: RES-TF-37; Value: 4K53; Sort Value: 4530; Category: Resistors; Subcategory: ThickFilm; HelpURL: *.pdf
R9 = RES-TF-13: 4K99, 1.1mm x 0.5mm, Thick Film Resistor; Manufacturer: ROYALOHM; PartNum: 0402WGF4991T1E; Rating: 0.0625W; POD number: RES-TF-13; Value: 4K99; Sort Value: 4990; Category: Resistors; Subcategory: ThickFilm; HelpURL: *.pdf
R11 R25 R28 = RES-MS-1: 2 milliohm, Power Metal Strip, Sense Resistor; Manufacturer: VISHAY; Tolerance: 1%; Rating: 1W; POD number: RES-MS-1; Value: 0R002; Sort Value: 0.002; Category: Resistors; Subcategory: MetalStrip
R13 = RES-WW-0: 10R, Cemented Wire Round Resistor; Manufacturer: VISHAY; PartNum: AC05000001009JLB00; Tolerance: 5%; Rating: 5W; POD number: RES-WW-0; Value: 10R; Sort Value: 10; Category: Resistors; Subcategory: WireWound
R14 = RES-TF-23: 4K75, 1.1mm x 0.5mm, Thick Film Resistor; Manufacturer: ROYALOHM; PartNum: 0402WGF4751T1E; Rating: 0.0625W; POD number: RES-TF-23; Value: 4K75; Sort Value: 4750; Category: Resistors; Subcategory: ThickFilm; HelpURL: *.pdf
R16 = RES-WW-1: 56R, Cemented Wire Round Resistor; Manufacturer: VISHAY; PartNum: AC05000001009JLB00; Tolerance: 5%; Rating: 5W; POD number: RES-WW-1; Value: 56R; Sort Value: 56; Category: Resistors; Subcategory: WireWound
R17 = RES-TF-26: 3K57, 1.1mm x 0.5mm, Thick Film Resistor; Manufacturer: ROYALOHM; PartNum: 0402WGF3751T1E; Rating: 0.0625W; POD number: RES-TF-26; Value: 3K75; Sort Value: 3750; Category: Resistors; Subcategory: ThickFilm; HelpURL: *.pdf
R18 = RES-TF-44: 6K49, 1.1mm x 0.5mm, Thick Film Resistor; POD number: RES-TF-44
R19 = RES-TF-28: 1K15, 1.1mm x 0.5mm, Thick Film Resistor; Manufacturer: ROYALOHM; PartNum: 0402WGF1150T1E; Rating: 0.0625W; POD number: RES-TF-28; Value: 1K15; Sort Value: 1150; Category: Resistors; Subcategory: ThickFilm; HelpURL: *.pdf
R20 = RES-TF-0: as R462-R467 on sheet jtag_levelxlate; POD number: RES-TF-0; Value: 0R; Sort Value: 0; Category: Resistors; Subcategory: ThickFilm; HelpURL: *.pdf
R21 = RES-MS-2: 1 milliohm, Power Metal Strip, Sense Resistor; Manufacturer: VISHAY; Tolerance: 1%; Rating: 1W; POD number: RES-MS-2; Value: 0R001; Sort Value: 0.001; Category: Resistors; Subcategory: MetalStrip
R23 = RES-TF-29: 19K6, 1.1mm x 0.5mm, Thick Film Resistor; Manufacturer: ROYALOHM; PartNum: 0402WGF1962T1E; Rating: 0.0625W; POD number: RES-TF-29; Value: 19K6; Sort Value: 19600; Category: Resistors; Subcategory: ThickFilm; HelpURL: *.pdf
R26 = RES-TF-30: 17K4, 1.1mm x 0.5mm, Thick Film Resistor; POD number: RES-TF-30
R27 = RES-MF-0: 0.25 milliohm, Power Metal Foil;, Sense Resistor; Manufacturer: STACKPOLE; Tolerance: 1%; Rating: 4W; POD number: RES-MF-0; Value: 0R00025; Sort Value: 0.00025; Category: Resistors; Subcategory: MetalFoil
R29 = RES-TF-33: 63K4, 1.1mm x 0.5mm, Thick Film Resistor; Manufacturer: ROYALOHM; PartNum: 0402WGF6342T1E; Rating: 0.0625W; POD number: RES-TF-33; Value: 63K4; Sort Value: 63400; Category: Resistors; Subcategory: ThickFilm; HelpURL: *.pdf
U3 = IC-REG-2: 10-A, 4.5-V to 14-V INPUT, NON-ISOLATED, WIDE-OUTPUT, ADJUSTABLE POWER MODULE WITH TurboTrans; Manufacturer: Texas Instruments; POD number: IC-REG-2; PartNum: PTH08T240WAD; RoHS: Y; Category: IC; Subcategory: Regulators
U4 U5 U7 = IC-REG-5: 3.0A Ultra-LDO with Programmable Soft-Start; Manufacturer: Texas Instruments; POD number: IC-REG-5; PartNum: TPS74401; RoHS: Y; Category: IC; Subcategory: Regulators
U6 = IC-REG-1: 16-A, 4.5-V to 14-V INPUT, NON-ISOLATED, WIDE-OUTPUT, ADJUSTABLE POWER MODULE WITH TurboTrans; Manufacturer: Texas Instruments; POD number: IC-REG-1; PartNum: PTH08T220WAD; RoHS: Y; Category: IC; Subcategory: Regulators
U8 = IC-REG-0: 30-A, 5.5V-14-V INPUT, NON-ISOLATED, WIDE OUTPUT ADJUST, POWER MODULE WITH TURBOTRANS; Manufacturer: Texas Instruments; POD number: IC-REG-0; PartNum: PTH08T210WAD; RoHS: Y; Category: IC; Subcategory: Regulators
U9 = IC-REG-3: 50-A, 4.5-V to 14-V INPUT, NON-ISOLATED,  WIDE-OUTPUT, ADJUSTABLE POWER MODULE WITH TurboTrans; Manufacturer: Texas Instruments; POD number: IC-REG-3; PartNum: PTH08T250WAD; RoHS: Y; Category: IC; Subcategory: Regulators
U90 U91 = IC-LOG-5: as U52 on sheet jtag_levelxlate; POD number: IC-LOG-5; PartNum: PI5A3157ZAEX; RoHS: Y; Category: IC; Subcategory: Logic

## Sheet ppc_cpld.SchDoc: PowerPC CPLD/MMC
size A3; Date: DO NOT USE, RATHER USE PROJ OPTIONS; DrawnBy: DO NOT USE, RATHER USE PROJ OPTIONS; Engineer: DO NOT USE, RATHER USE PROJ OPTIONS; Organization: DO NOT USE, RATHER USE PROJ OPTIONS; DocumentNumber: DO NOT USE, RATHER USE PROJ OPTIONS; Revision: DO NOT USE, RATHER USE PROJ OPTIONS; SheetNumber: 10; SheetTotal: 29; SCH_Sheet_Filename: ppc_cpld.SchDoc; CurrentTime: DO NOT USE, RATHER USE PROJ OPTIONS; Time: DO NOT USE, RATHER USE PROJ OPTIONS; DocumentFullPathAndName: DO NOT USE, RATHER USE PROJ OPTIONS; DocumentName: DO NOT USE, RATHER USE PROJ OPTIONS; ModifiedDate: DO NOT USE, RATHER USE PROJ OPTIONS; ImagePath: DO NOT USE, RATHER USE PROJ OPTIONS
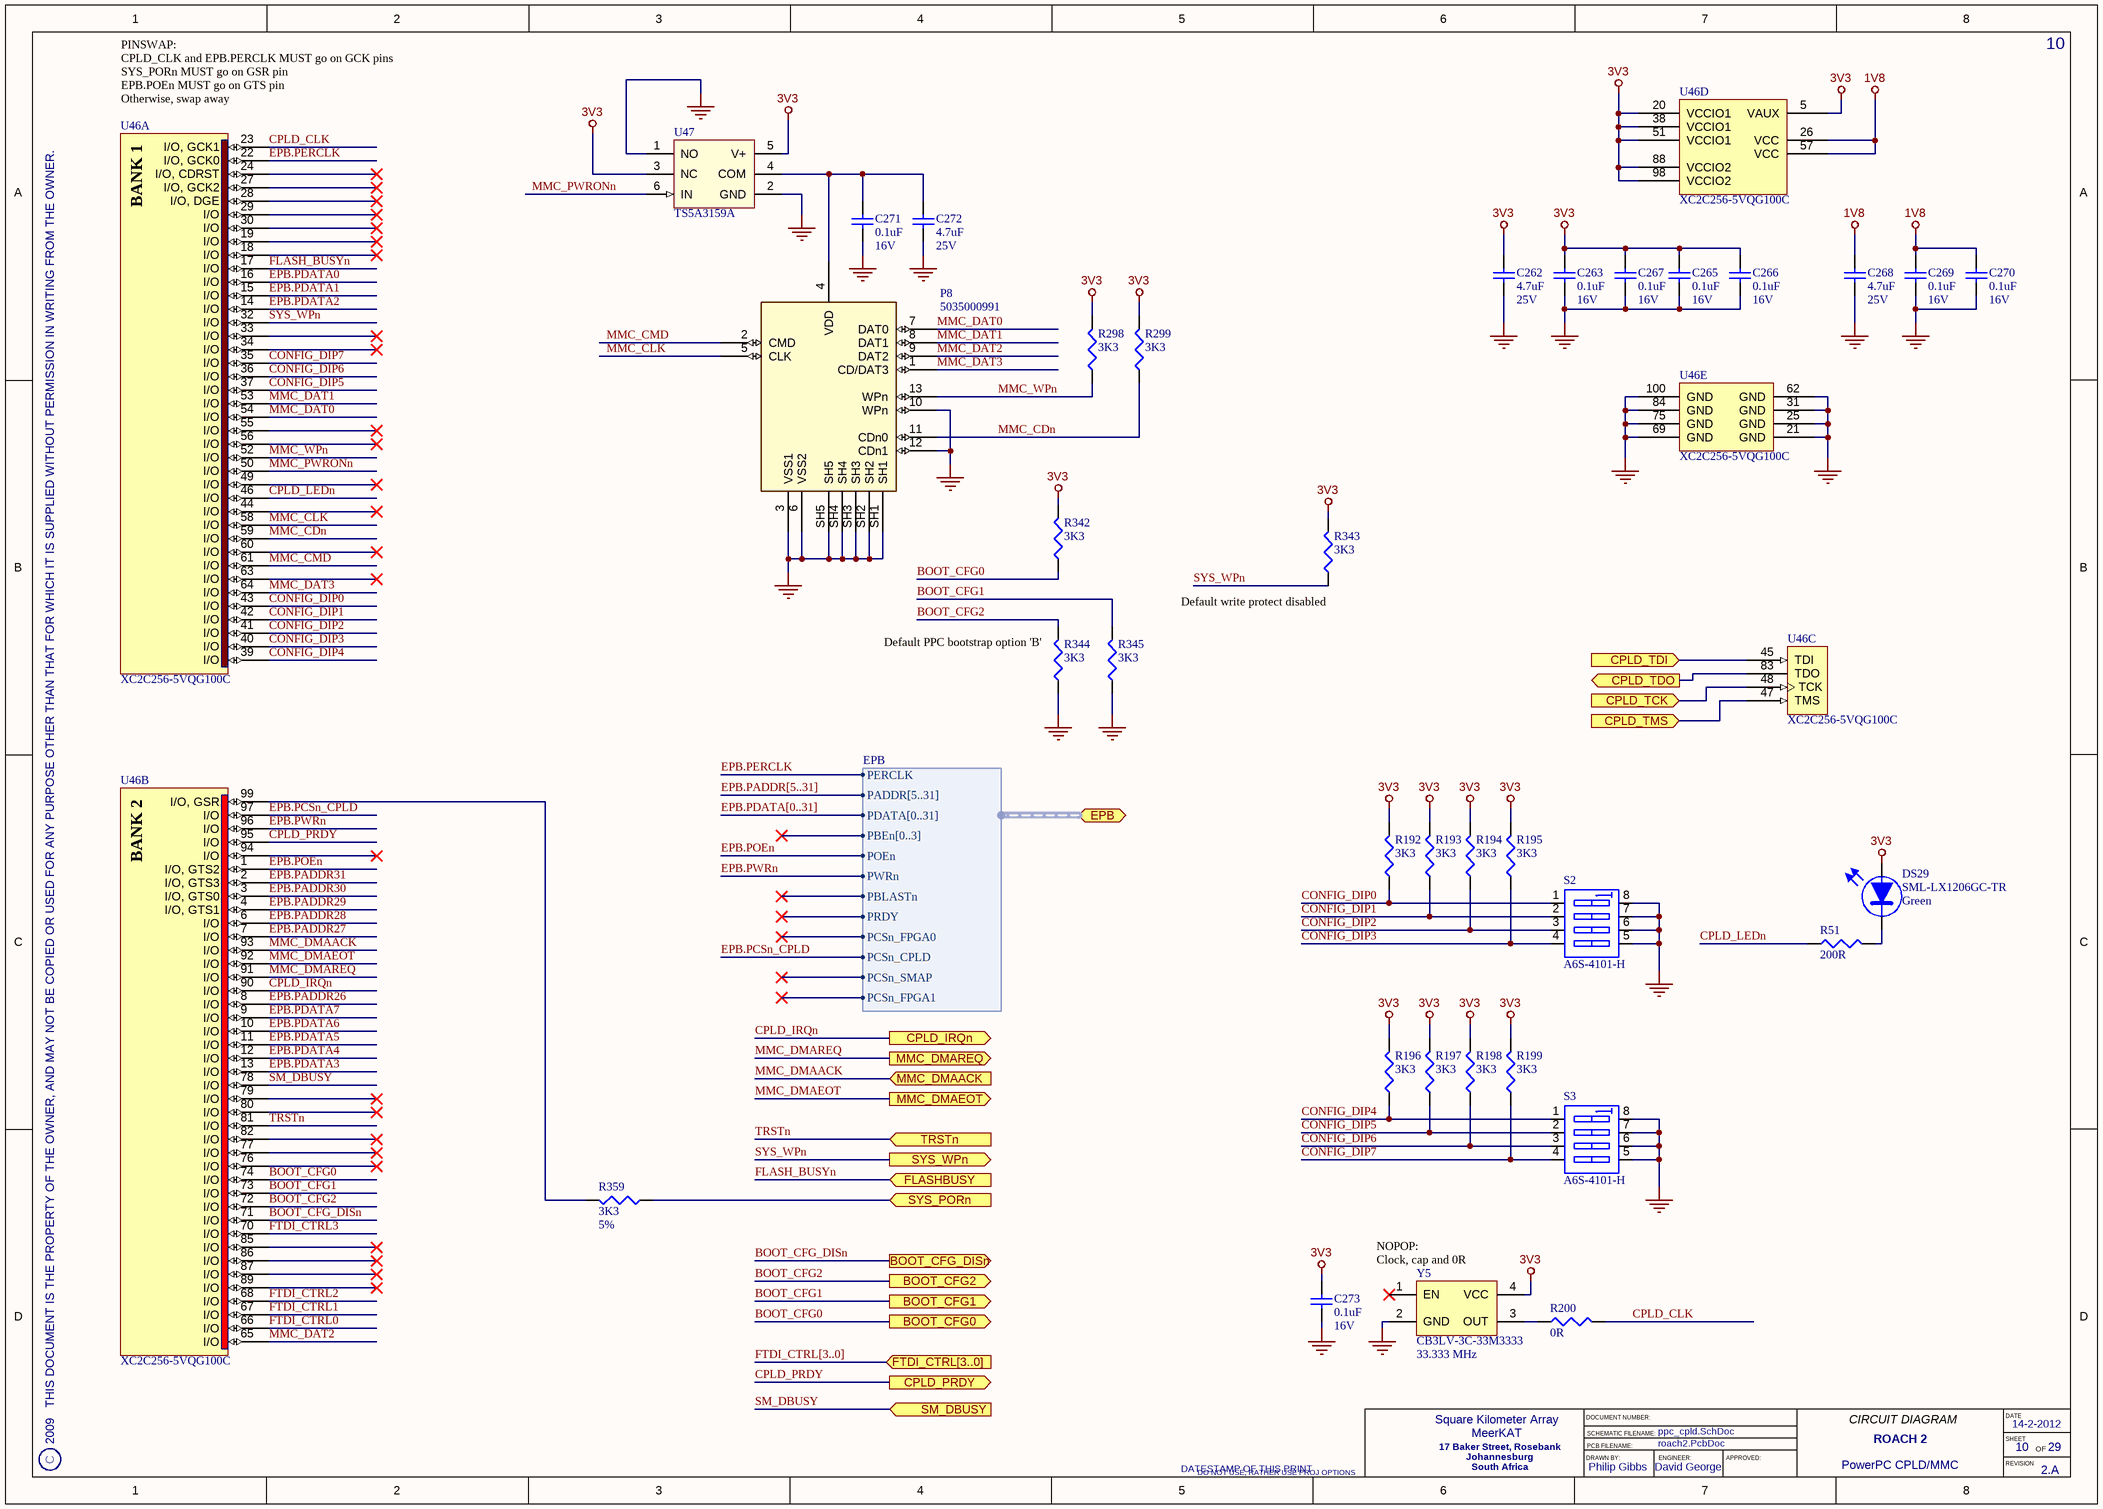
[diagram p6: ppc_cpld.SchDoc]

### Parts
C262  Rating: 25V  [CAPC2012X127L]  (hidden comment: 4.7uF)
C263  Rating: 16V  [CAPC1005X60L]  (hidden comment: 0.1uF)
C265  Rating: 16V  [CAPC1005X60L]  (hidden comment: 0.1uF)
C266  Rating: 16V  [CAPC1005X60L]  (hidden comment: 0.1uF)
C267  Rating: 16V  [CAPC1005X60L]  (hidden comment: 0.1uF)
C268  Rating: 25V  [CAPC2012X127L]  (hidden comment: 4.7uF)
C269  Rating: 16V  [CAPC1005X60L]  (hidden comment: 0.1uF)
C270  Rating: 16V  [CAPC1005X60L]  (hidden comment: 0.1uF)
C271  Rating: 16V  [CAPC1005X60L]  (hidden comment: 0.1uF)
C272  Rating: 25V  [CAPC2012X127L]  (hidden comment: 4.7uF)
C273  Rating: 16V  [CAPC1005X60L]  (hidden comment: 0.1uF)
DS29  SML-LX1206GC-TR  Colour: Green  [LEDC3216X120N]
P8  5035000991  [MOLEX_5035000991]
R51  200R  [RESC1005X40L]
R192  3K3  [RESC1005X40L]
R193  3K3  [RESC1005X40L]
R194  3K3  [RESC1005X40L]
R195  3K3  [RESC1005X40L]
R196  3K3  [RESC1005X40L]
R197  3K3  [RESC1005X40L]
R198  3K3  [RESC1005X40L]
R199  3K3  [RESC1005X40L]
R200  0R  [RESC1005X40L]
R298  3K3  [RESC1005X40L]
R299  3K3  [RESC1005X40L]
R342  3K3  [RESC1005X40L]
R343  3K3  [RESC1005X40L]
R344  3K3  [RESC1005X40L]
R345  3K3  [RESC1005X40L]
R359  Tolerance: 5%  [RESC1005X40L]  (hidden comment: 3K3)
S2  A6S-4101-H  [A6S-4101-H]
S3  A6S-4101-H  [A6S-4101-H]
U46  XC2C256-5VQG100C  [VQG100_L]  (parts A,B,C,D,E of 5)
U47  TS5A3159A  [SOT23-6]
Y5  Frequency: 33.333 MHz  [CB3X-X-XMX]  (hidden comment: CB3LV-3C-33M3333)

### Ports
BOOT_CFG0 (out), BOOT_CFG1 (out), BOOT_CFG2 (out), BOOT_CFG_DISn (out), CPLD_IRQn (out), CPLD_PRDY (out), CPLD_TCK (in), CPLD_TDI (in), CPLD_TDO (out), CPLD_TMS (in), EPB (harness EPB), FLASHBUSY (in), FTDI_CTRL[3..0] (in), MMC_DMAACK (in), MMC_DMAEOT (out), MMC_DMAREQ (out), SM_DBUSY (in), SYS_PORn (in), SYS_WPn (out), TRSTn (in)

### Harnesses
EPB: PERCLK, PADDR[5..31], PDATA[0..31], PBEn[0..3], POEn, PWRn, PBLASTn, PRDY, PCSn_FPGA0, PCSn_CPLD, PCSn_SMAP, PCSn_FPGA1

### Nets
1V8: C268.2 C269.2 C270.2 U46.26(VCC) U46.57(VCC)
3V3: C262.2 C263.2 C265.2 C266.2 C267.2 C273.2 DS29.2(A) R192.2 R193.2 R194.2 R195.2 R196.2 R197.2 R198.2 R199.2 R298.2 R299.2 R342.2 R343.2 U46.5(VAUX) U46.20(VCCIO1) U46.38(VCCIO1) U46.51(VCCIO1) U46.88(VCCIO2) U46.98(VCCIO2) U47.3(NC) U47.5(V+) Y5.4(VCC)
GND: C262.1 C263.1 C265.1 C266.1 C267.1 C268.1 C269.1 C270.1 C271.1 C272.1 C273.1 P8.3(VSS1) P8.6(VSS2) P8.10(WPn) P8.12(CDn1) P8.SH1 P8.SH2 P8.SH3 P8.SH4 P8.SH5 R344.1 R345.1 S2.5(SW4B) S2.6(SW3B) S2.7(SW2B) S2.8(SW1B) S3.5(SW4B) S3.6(SW3B) S3.7(SW2B) S3.8(SW1B) U46.21(GND) U46.25(GND) U46.31(GND) U46.62(GND) U46.69(GND) U46.75(GND) U46.84(GND) U46.100(GND) U47.1(NO) U47.2(GND) Y5.2(GND)
BOOT_CFG0: R342.1 U46.74(I/O) ; port BOOT_CFG0
BOOT_CFG1: R345.2 U46.73(I/O) ; port BOOT_CFG1
BOOT_CFG2: R344.2 U46.72(I/O) ; port BOOT_CFG2
BOOT_CFG_DISn: U46.71(I/O) ; port BOOT_CFG_DISn
CONFIG_DIP0: R192.1 S2.1(SW1A) U46.43(I/O)
CONFIG_DIP1: R193.1 S2.2(SW2A) U46.42(I/O)
CONFIG_DIP2: R194.1 S2.3(SW3A) U46.41(I/O)
CONFIG_DIP3: R195.1 S2.4(SW4A) U46.40(I/O)
CONFIG_DIP4: R196.1 S3.1(SW1A) U46.39(I/O)
CONFIG_DIP5: R197.1 S3.2(SW2A) U46.37(I/O)
CONFIG_DIP6: R198.1 S3.3(SW3A) U46.36(I/O)
CONFIG_DIP7: R199.1 S3.4(SW4A) U46.35(I/O)
CPLD_CLK: R200.2 U46.23(I/O,_GCK1)
CPLD_IRQn: U46.90(I/O) ; port CPLD_IRQn
CPLD_LEDn: R51.1 U46.46(I/O)
CPLD_PRDY: U46.95(I/O) ; port CPLD_PRDY
CPLD_TCK: U46.48(TCK) ; port CPLD_TCK
CPLD_TDI: U46.45(TDI) ; port CPLD_TDI
CPLD_TDO: U46.83(TDO) ; port CPLD_TDO
CPLD_TMS: U46.47(TMS) ; port CPLD_TMS
EPB.PADDR26: U46.8(I/O)
EPB.PADDR27: U46.7(I/O)
EPB.PADDR28: U46.6(I/O)
EPB.PADDR29: U46.4(I/O,_GTS1)
EPB.PADDR30: U46.3(I/O,_GTS0)
EPB.PADDR31: U46.2(I/O,_GTS3)
EPB.PCSn_CPLD: U46.97(I/O) ; port EPB.PCSn_CPLD
EPB.PDATA0: U46.16(I/O)
EPB.PDATA1: U46.15(I/O)
EPB.PDATA2: U46.14(I/O)
EPB.PDATA3: U46.13(I/O)
EPB.PDATA4: U46.12(I/O)
EPB.PDATA5: U46.11(I/O)
EPB.PDATA6: U46.10(I/O)
EPB.PDATA7: U46.9(I/O)
EPB.PERCLK: U46.22(I/O,_GCK0) ; port EPB.PERCLK
EPB.POEn: U46.1(I/O,_GTS2) ; port EPB.POEn
EPB.PWRn: U46.96(I/O) ; port EPB.PWRn
FLASH_BUSYn: U46.17(I/O) ; port FLASHBUSY
FTDI_CTRL0: U46.66(I/O)
FTDI_CTRL1: U46.67(I/O)
FTDI_CTRL2: U46.68(I/O)
FTDI_CTRL3: U46.70(I/O)
MMC_CDn: P8.11(CDn0) R299.1 U46.59(I/O)
MMC_CLK: P8.5(CLK) U46.58(I/O)
MMC_CMD: P8.2(CMD) U46.61(I/O)
MMC_DAT0: P8.7(DAT0) U46.54(I/O)
MMC_DAT1: P8.8(DAT1) U46.53(I/O)
MMC_DAT2: P8.9(DAT2) U46.65(I/O)
MMC_DAT3: P8.1(CD/DAT3) U46.64(I/O)
MMC_DMAACK: U46.93(I/O) ; port MMC_DMAACK
MMC_DMAEOT: U46.92(I/O) ; port MMC_DMAEOT
MMC_DMAREQ: U46.91(I/O) ; port MMC_DMAREQ
MMC_PWRONn: U46.50(I/O) U47.6(IN)
MMC_WPn: P8.13(WPn) R298.1 U46.52(I/O)
SM_DBUSY: U46.78(I/O) ; port SM_DBUSY
SYS_PORn: R359.1 ; port SYS_PORn
SYS_WPn: R343.1 U46.32(I/O) ; port SYS_WPn
TRSTn: U46.81(I/O) ; port TRSTn
NetC271_2: C271.2 C272.2 P8.4(VDD) U47.4(COM)
NetDS29_1: DS29.1(K) R51.2
NetR200_1: R200.1 Y5.3(OUT)
NetR359_2: R359.2 U46.99(I/O,_GSR)

Not connected (* = marked no-connect by the designer): U46 18(I/O)* 19(I/O)* 24(I/O,_CDRST)* 27(I/O,_GCK2)* 28(I/O,_DGE)* 29(I/O)* 30(I/O)* 33(I/O)* 34(I/O)* 44(I/O)* 49(I/O)* 55(I/O)* 56(I/O)* 60(I/O)* 63(I/O)* 76(I/O)* 77(I/O)* 79(I/O)* 80(I/O)* 82(I/O)* 85(I/O)* 86(I/O)* 87(I/O)* 89(I/O)* 94(I/O)*; Y5 1(EN)*

### Buses and harness runs
bus EPB.PADDR[5..31]
bus EPB.PDATA[0..31]
bus FTDI_CTRL[3..0] = port FTDI_CTRL[3..0]

### Notes on the sheet
- (near U46) PINSWAP:
  CPLD_CLK and EPB.PERCLK MUST go on GCK pins
  SYS_PORn MUST go on GSR pin
  EPB.POEn MUST go on GTS pin
  Otherwise, swap away
- (near R344) Default PPC bootstrap option 'B'
- (near R343) Default write protect disabled
- (near Y5) NOPOP:
  Clock, cap and 0R
- 2009   THIS DOCUMENT IS THE PROPERTY OF THE OWNER, AND MAY NOT BE COPIED OR USED FOR ANY PURPOSE OTHER THAN THAT FOR WHICH IT IS SUPPLIED WITHOUT PERMISSION IN WRITING FROM THE OWNER.
- C
- DATESTAMP OF THIS PRINT
- DRAWN BY:
- DOCUMENT NUMBER:
- SCHEMATIC FILENAME:
- PCB FILENAME:
- ENGINEER:
- APPROVED:
- CIRCUIT DIAGRAM
- DATE
- SHEET
- REVISION
- OF
- (in symbol IC-PLD-1, part A) BANK 1
- (in symbol IC-PLD-1, part B) BANK 2

### Library data of the parts
C262 C268 C272 = CAP-CER-3: as C730 on sheet jtag_levelxlate; POD number: CAP-CER-3; Value: 4.7uF; RoHS: Y; Sort Value: 4.7; Category: Capacitors; Subcategory: Ceramic
C263 C265-C267 C269-C271 C273 = CAP-CER-1: as C53 on sheet jtag_levelxlate; POD number: CAP-CER-1; Value: 0.1uF; RoHS: Y; Sort Value: 0.1; Category: Capacitors; Subcategory: Ceramic
DS29 = OPTO-LED-0: Green, Surface mount, LED, 1206; Manufacturer: LUMEX; Vdrop: 2.2V; Rating: 20mA; POD number: OPTO-LED-0; PartNum: SML-LX1206GC-TR; RoHS: Y; Category: OPTO; Subcategory: LED
P8 = CONN-PCB-24: Push/Push SD Card Connector with Card Detection; Manufacturer: Molex; POD number: CONN-PCB-24; PartNum: 5035000991; RoHS: Y; Category: CONN; Subcategory: PCB
R51 = RES-TF-19: 200R, 1.1mm x 0.5mm, Thick Film Resistor; Manufacturer: ROYALOHM; PartNum: 0402WGF0201T1E; Tolerance: 1%; Rating: 0.0625W; POD number: RES-TF-19; Value: 200R; Sort Value: 200; Category: Resistors; Subcategory: ThickFilm; HelpURL: *.pdf
R192-R199 R298 R299 R342-R345 = RES-TF-7: as R49 on sheet jtag_levelxlate; POD number: RES-TF-7; Value: 3K3; Sort Value: 3300; Category: Resistors; Subcategory: ThickFilm; HelpURL: *.pdf
R200 = RES-TF-0: as R462-R467 on sheet jtag_levelxlate; POD number: RES-TF-0; Value: 0R; Sort Value: 0; Category: Resistors; Subcategory: ThickFilm; HelpURL: *.pdf
R359 = RES-TF-7: 3K3, 1.1mm x 0.5mm, Thick Film Resistor; Manufacturer: ROYALOHM; PartNum: 0402WGJ0332T1E; Rating: 0.0625W; POD number: RES-TF-7; RoHS: Y; Value: 3K3; Sort Value: 3300; Category: Resistors; Subcategory: ThickFilm; HelpURL: http://www.royalohm.com/pdf/general.pdf
S2 S3 = ELMECH-SW-0: 4-Input, Surface mount, DIP Switch; Manufacturer: OMRON; POD number: ELMECH-SW-0; PartNum: A6S-4101-H; RoHS: Y; Category: ELMECH; Subcategory: Switches
U46 = IC-PLD-1: CoolRunner-II, 1.8V, 256 Macrocell CPLD, 100-Pin VQFP, Pb-Free, Commercial Grade; Manufacturer: Xilinx; POD number: IC-PLD-1; PartNum: XC2C256-5VQG100C; RoHS: Y; Category: IC; Subcategory: PLD
U47 = IC-LOG-6: 6-pin 1 Ohm analogue switch; Manufacturer: Texas Instruments; POD number: IC-LOG-6; PartNum: TS5A3159A; RoHS: Y; Category: IC; Subcategory: Logic
Y5 = RESN-CLK-1: Surface mount, 33.3333 MHz, 3V3 Clock, oscillator; Manufacturer: CTS; POD number: RESN-CLK-1; PartNum: CB3LV-3C-33M3333; RoHS: Y; Category: RESN; Subcategory: Clock Oscillators